# Altium project clock.PrjPcb (part 1 of 2)
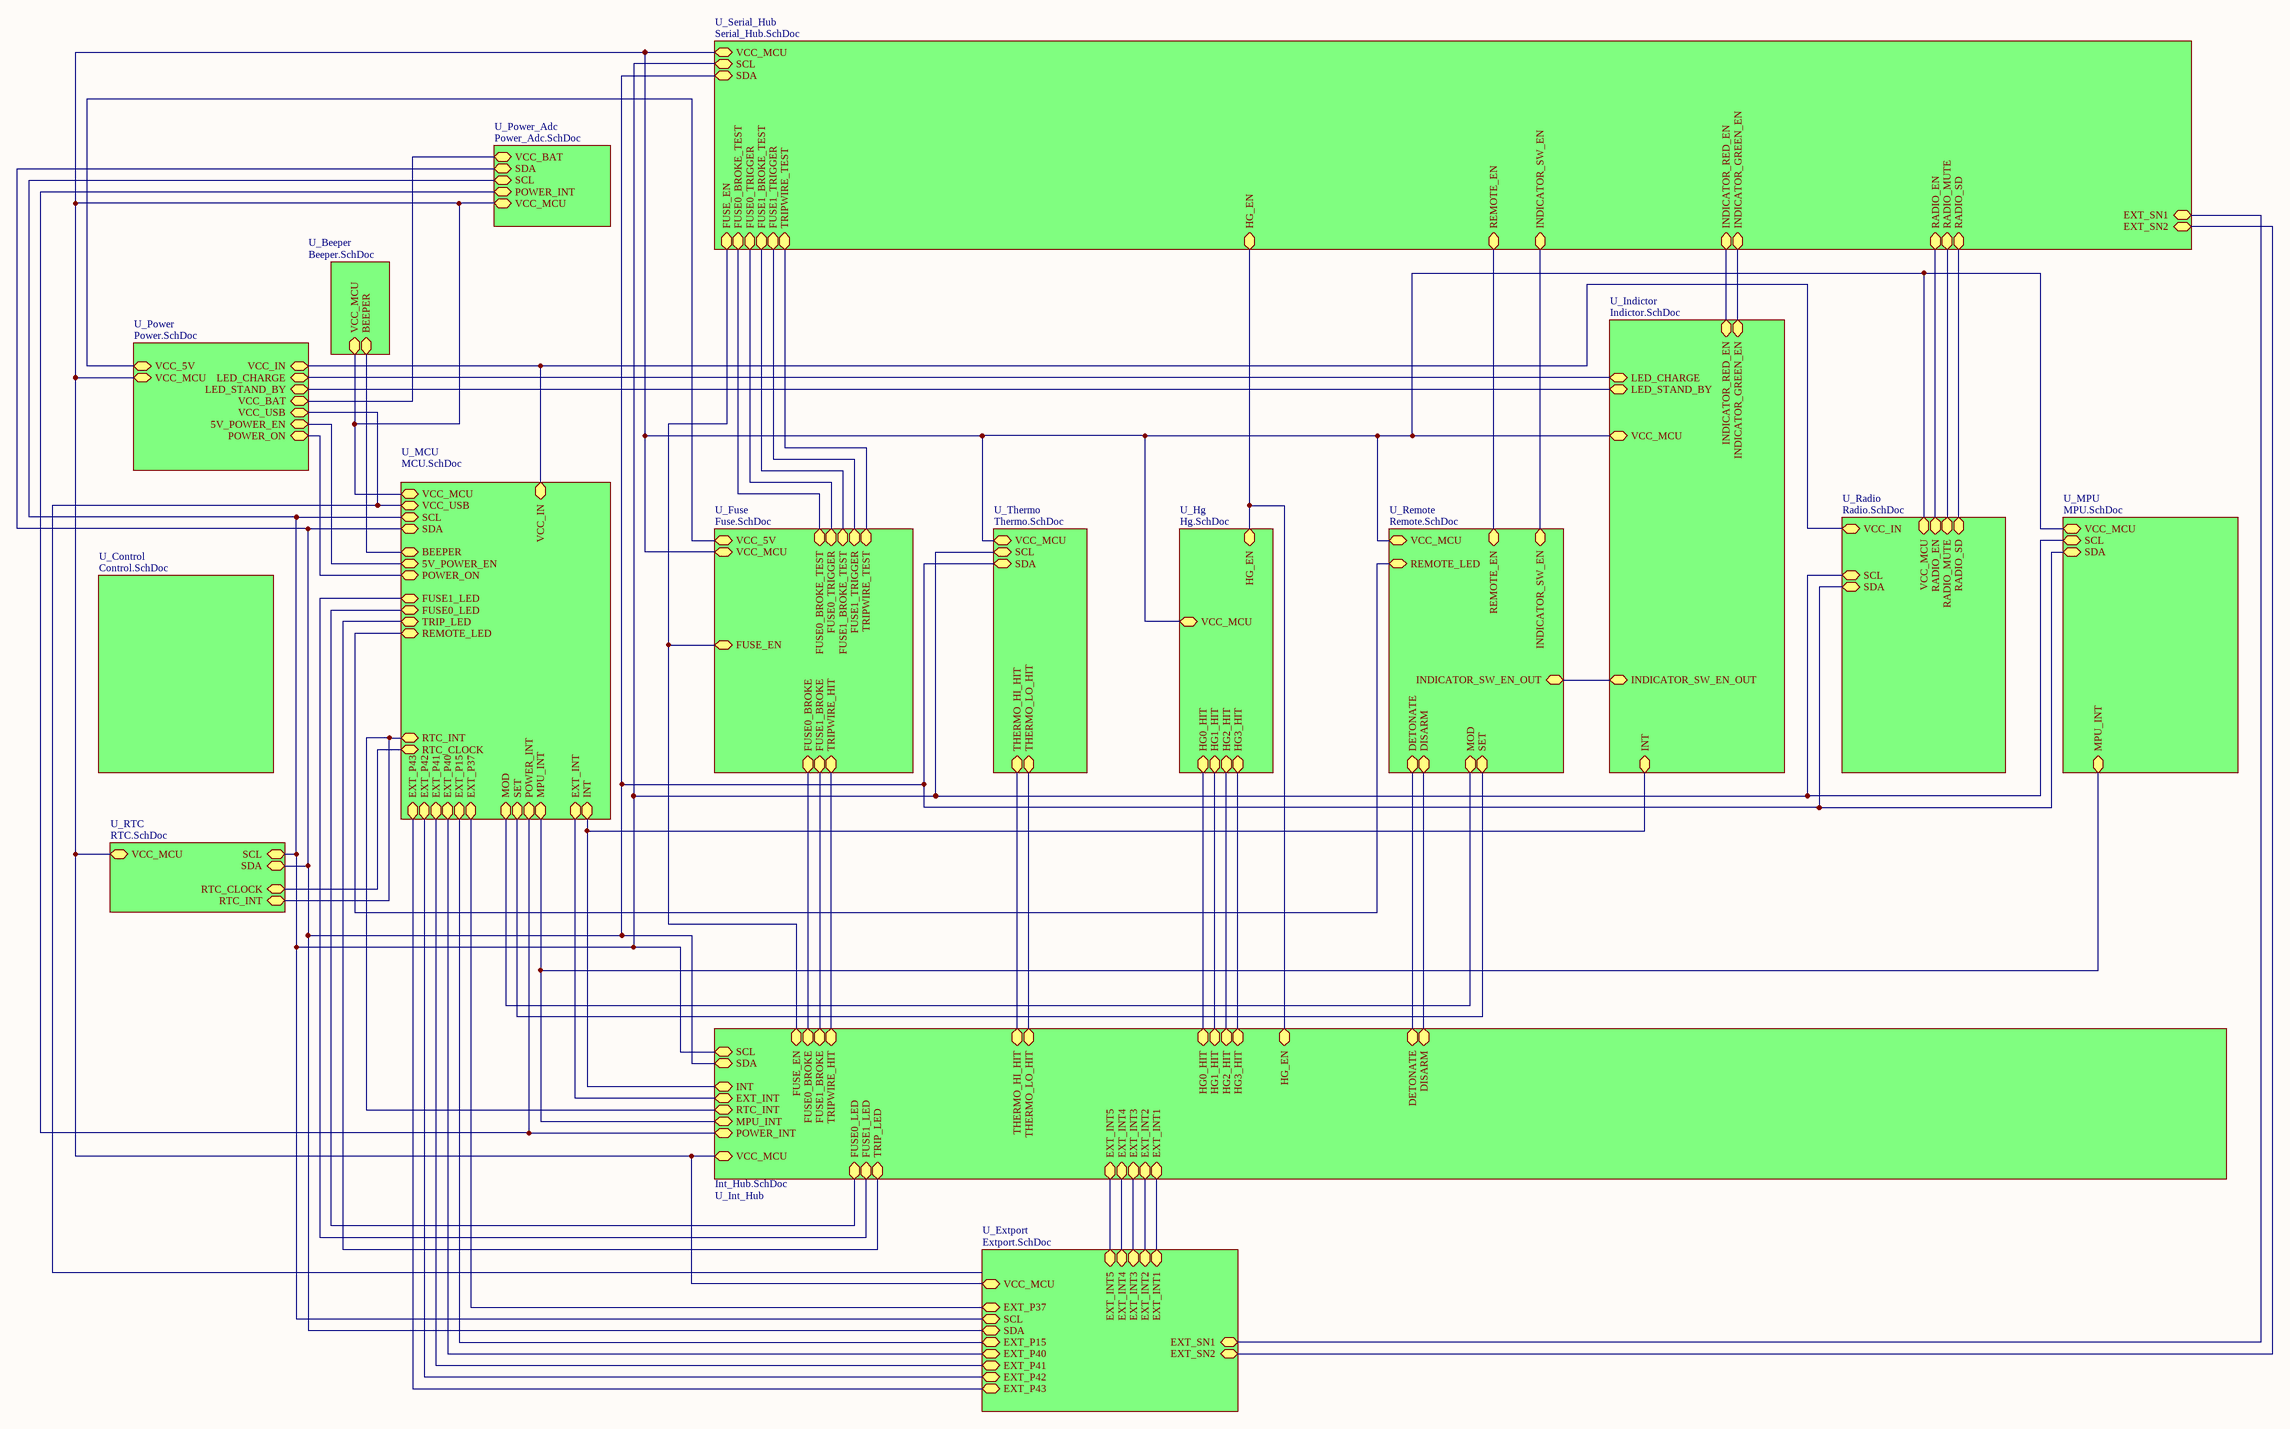
[diagram p0: Main.SchDoc]
17 sheets, 279 parts. Net scope: hierarchical (ports join the sheet entries above them; power ports are global).
Board files: Main.PcbDoc, DSS0012A.PcbDoc, DRC0010G.PcbDoc, DBV6.PcbDoc, sot23.PcbDoc, QFN24.PcbDoc
Sheets:
  Main.SchDoc
    U_Power = Power.SchDoc
    U_MCU = MCU.SchDoc
    U_RTC = RTC.SchDoc
    U_Fuse = Fuse.SchDoc
    U_MPU = MPU.SchDoc
    U_Hg = Hg.SchDoc
    U_Thermo = Thermo.SchDoc
    U_Indictor = Indictor.SchDoc
    U_Radio = Radio.SchDoc
    U_Serial_Hub = Serial_Hub.SchDoc
    U_Int_Hub = Int_Hub.SchDoc
    U_Remote = Remote.SchDoc
    U_Beeper = Beeper.SchDoc
    U_Power_Adc = Power_Adc.SchDoc
    U_Control = Control.SchDoc
    U_Extport = Extport.SchDoc

## Sheet Main.SchDoc
size A2

### Sub-sheets
U_Beeper = Beeper.SchDoc: BEEPER (bidir), VCC_MCU (bidir)
U_Control = Control.SchDoc: no entries
U_Extport = Extport.SchDoc: SDA (bidir), VCC_MCU (bidir), EXT_INT5 (bidir), EXT_INT4 (bidir), EXT_INT3 (bidir), EXT_INT2 (bidir), EXT_INT1 (bidir), EXT_SN1 (bidir), EXT_SN2 (bidir), EXT_P15 (bidir), EXT_P40 (bidir), EXT_P41 (bidir), EXT_P42 (bidir), EXT_P43 (bidir), EXT_P37 (bidir), SCL (bidir)
U_Fuse = Fuse.SchDoc: VCC_5V (bidir), FUSE0_TRIGGER (bidir), FUSE0_BROKE (bidir), FUSE0_BROKE_TEST (bidir), VCC_MCU (bidir), FUSE_EN (bidir), FUSE1_TRIGGER (bidir), FUSE1_BROKE (bidir), FUSE1_BROKE_TEST (bidir), TRIPWIRE_HIT (bidir), TRIPWIRE_TEST (bidir)
U_Hg = Hg.SchDoc: VCC_MCU (bidir), HG_EN (bidir), HG0_HIT (bidir), HG1_HIT (bidir), HG2_HIT (bidir), HG3_HIT (bidir)
U_Indictor = Indictor.SchDoc: VCC_MCU (bidir), INDICATOR_RED_EN (bidir), INDICATOR_GREEN_EN (bidir), INT (bidir), LED_CHARGE (bidir), LED_STAND_BY (bidir), INDICATOR_SW_EN_OUT (bidir)
U_Int_Hub = Int_Hub.SchDoc: VCC_MCU (bidir), SCL (bidir), SDA (bidir), INT (bidir), FUSE0_BROKE (bidir), FUSE1_BROKE (bidir), HG0_HIT (bidir), HG1_HIT (bidir), HG2_HIT (bidir), HG3_HIT (bidir), FUSE_EN (bidir), HG_EN (bidir), TRIPWIRE_HIT (bidir), EXT_INT (bidir), RTC_INT (bidir), MPU_INT (bidir), THERMO_HI_HIT (bidir), THERMO_LO_HIT (bidir), POWER_INT (bidir), DETONATE (bidir), DISARM (bidir), TRIP_LED (bidir), FUSE0_LED (bidir), FUSE1_LED (bidir), EXT_INT5 (bidir), EXT_INT4 (bidir), EXT_INT1 (bidir), EXT_INT2 (bidir), EXT_INT3 (bidir)
U_MCU = MCU.SchDoc: VCC_MCU (bidir), BEEPER (bidir), RTC_INT (bidir), EXT_INT (bidir), INT (bidir), RTC_CLOCK (bidir), VCC_USB (bidir), 5V_POWER_EN (bidir), POWER_INT (bidir), SCL (bidir), SDA (bidir), MOD (bidir), SET (bidir), POWER_ON (bidir), VCC_IN (bidir), MPU_INT (bidir), FUSE1_LED (bidir), FUSE0_LED (bidir), TRIP_LED (bidir), REMOTE_LED (bidir), EXT_P41 (bidir), EXT_P42 (bidir), EXT_P40 (bidir), EXT_P15 (bidir), EXT_P43 (bidir), EXT_P37 (bidir)
U_MPU = MPU.SchDoc: VCC_MCU (bidir), SCL (bidir), SDA (bidir), MPU_INT (bidir)
U_Power = Power.SchDoc: VCC_BAT (bidir), VCC_MCU (bidir), LED_CHARGE (bidir), LED_STAND_BY (bidir), VCC_IN (bidir), VCC_5V (bidir), 5V_POWER_EN (bidir), POWER_ON (bidir), VCC_USB (bidir)
U_Power_Adc = Power_Adc.SchDoc: VCC_BAT (bidir), SDA (bidir), SCL (bidir), POWER_INT (bidir), VCC_MCU (bidir)
U_Radio = Radio.SchDoc: VCC_IN (bidir), RADIO_EN (bidir), SDA (bidir), SCL (bidir), RADIO_MUTE (bidir), RADIO_SD (bidir), VCC_MCU (bidir)
U_Remote = Remote.SchDoc: VCC_MCU (bidir), REMOTE_EN (bidir), SET (bidir), MOD (bidir), DISARM (bidir), DETONATE (bidir), INDICATOR_SW_EN (bidir), INDICATOR_SW_EN_OUT (bidir), REMOTE_LED (bidir)
U_RTC = RTC.SchDoc: VCC_MCU (bidir), SCL (bidir), SDA (bidir), RTC_CLOCK (bidir), RTC_INT (bidir)
U_Serial_Hub = Serial_Hub.SchDoc: HG_EN (bidir), FUSE0_TRIGGER (bidir), FUSE1_TRIGGER (bidir), SCL (bidir), SDA (bidir), VCC_MCU (bidir), FUSE_EN (bidir), FUSE0_BROKE_TEST (bidir), FUSE1_BROKE_TEST (bidir), TRIPWIRE_TEST (bidir), INDICATOR_SW_EN (bidir), INDICATOR_RED_EN (bidir), INDICATOR_GREEN_EN (bidir), RADIO_MUTE (bidir), RADIO_SD (bidir), RADIO_EN (bidir), REMOTE_EN (bidir), EXT_SN1 (bidir), EXT_SN2 (bidir)
U_Thermo = Thermo.SchDoc: SCL (bidir), SDA (bidir), THERMO_HI_HIT (bidir), THERMO_LO_HIT (bidir), VCC_MCU (bidir)

### Nets
VCC_5V: sheet U_Power/VCC_5V, sheet U_Fuse/VCC_5V
VCC_BAT: sheet U_Power/VCC_BAT, sheet U_Power_Adc/VCC_BAT
VCC_IN: sheet U_Power/VCC_IN, sheet U_MCU/VCC_IN, sheet U_Radio/VCC_IN
VCC_MCU: sheet U_Power/VCC_MCU, sheet U_MCU/VCC_MCU, sheet U_RTC/VCC_MCU, sheet U_Fuse/VCC_MCU, sheet U_MPU/VCC_MCU, sheet U_Hg/VCC_MCU, sheet U_Thermo/VCC_MCU, sheet U_Indictor/VCC_MCU, sheet U_Radio/VCC_MCU, sheet U_Serial_Hub/VCC_MCU, sheet U_Int_Hub/VCC_MCU, sheet U_Remote/VCC_MCU, sheet U_Beeper/VCC_MCU, sheet U_Power_Adc/VCC_MCU, sheet U_Extport/VCC_MCU
VCC_USB: sheet U_Power/VCC_USB, sheet U_MCU/VCC_USB
EXT_INT: sheet U_MCU/EXT_INT, sheet U_Int_Hub/EXT_INT
MOD: sheet U_MCU/MOD, sheet U_Remote/MOD
MPU_INT: sheet U_MCU/MPU_INT, sheet U_MPU/MPU_INT, sheet U_Int_Hub/MPU_INT
POWER_INT: sheet U_MCU/POWER_INT, sheet U_Int_Hub/POWER_INT, sheet U_Power_Adc/POWER_INT
POWER_ON: sheet U_Power/POWER_ON, sheet U_MCU/POWER_ON
RTC_INT: sheet U_MCU/RTC_INT, sheet U_RTC/RTC_INT, sheet U_Int_Hub/RTC_INT
SCL: sheet U_MCU/SCL, sheet U_RTC/SCL, sheet U_MPU/SCL, sheet U_Thermo/SCL, sheet U_Radio/SCL, sheet U_Serial_Hub/SCL, sheet U_Int_Hub/SCL, sheet U_Power_Adc/SCL, sheet U_Extport/SCL
SDA: sheet U_MCU/SDA, sheet U_RTC/SDA, sheet U_MPU/SDA, sheet U_Thermo/SDA, sheet U_Radio/SDA, sheet U_Serial_Hub/SDA, sheet U_Int_Hub/SDA, sheet U_Power_Adc/SDA, sheet U_Extport/SDA
SET: sheet U_MCU/SET, sheet U_Remote/SET
NetK1_5: sheet U_Fuse/FUSE1_BROKE, sheet U_Int_Hub/FUSE1_BROKE
NetK2_5: sheet U_Fuse/FUSE0_BROKE, sheet U_Int_Hub/FUSE0_BROKE
NetP1_2: sheet U_Fuse/TRIPWIRE_HIT, sheet U_Int_Hub/TRIPWIRE_HIT
NetP10_2: sheet U_MCU/EXT_P37, sheet U_Extport/EXT_P37
NetP10_3: sheet U_Int_Hub/EXT_INT5, sheet U_Extport/EXT_INT5
NetP10_4: sheet U_MCU/EXT_P15, sheet U_Extport/EXT_P15
NetP10_5: sheet U_Int_Hub/EXT_INT4, sheet U_Extport/EXT_INT4
NetP10_6: sheet U_MCU/EXT_P40, sheet U_Extport/EXT_P40
NetP10_7: sheet U_Int_Hub/EXT_INT3, sheet U_Extport/EXT_INT3
NetP10_8: sheet U_MCU/EXT_P41, sheet U_Extport/EXT_P41
NetP10_9: sheet U_Int_Hub/EXT_INT2, sheet U_Extport/EXT_INT2
NetP10_10: sheet U_MCU/EXT_P42, sheet U_Extport/EXT_P42
NetP10_11: sheet U_Int_Hub/EXT_INT1, sheet U_Extport/EXT_INT1
NetP10_12: sheet U_MCU/EXT_P43, sheet U_Extport/EXT_P43
NetP10_13: sheet U_Serial_Hub/EXT_SN1, sheet U_Extport/EXT_SN1
NetP10_15: sheet U_Serial_Hub/EXT_SN2, sheet U_Extport/EXT_SN2
NetQ2_2: sheet U_Hg/HG_EN, sheet U_Serial_Hub/HG_EN, sheet U_Int_Hub/HG_EN
NetQ11_2: sheet U_Fuse/FUSE_EN, sheet U_Serial_Hub/FUSE_EN, sheet U_Int_Hub/FUSE_EN
NetQ14_2: sheet U_Power/5V_POWER_EN, sheet U_MCU/5V_POWER_EN
NetQ18_2: sheet U_Radio/RADIO_EN, sheet U_Serial_Hub/RADIO_EN
NetQ19_2: sheet U_Serial_Hub/REMOTE_EN, sheet U_Remote/REMOTE_EN
NetR1_1: sheet U_MCU/BEEPER, sheet U_Beeper/BEEPER
NetR3_1: sheet U_Hg/HG0_HIT, sheet U_Int_Hub/HG0_HIT
NetR4_1: sheet U_Hg/HG2_HIT, sheet U_Int_Hub/HG2_HIT
NetR5_1: sheet U_Hg/HG1_HIT, sheet U_Int_Hub/HG1_HIT
NetR6_1: sheet U_Hg/HG3_HIT, sheet U_Int_Hub/HG3_HIT
NetR8_1: sheet U_MCU/FUSE0_LED, sheet U_Int_Hub/FUSE0_LED
NetR9_1: sheet U_MCU/TRIP_LED, sheet U_Int_Hub/TRIP_LED
NetR11_1: sheet U_MCU/INT, sheet U_Indictor/INT, sheet U_Int_Hub/INT
NetR12_1: sheet U_MCU/FUSE1_LED, sheet U_Int_Hub/FUSE1_LED
NetR19_1: sheet U_MCU/RTC_CLOCK, sheet U_RTC/RTC_CLOCK
NetR20_1: sheet U_Thermo/THERMO_HI_HIT, sheet U_Int_Hub/THERMO_HI_HIT
NetR21_1: sheet U_Thermo/THERMO_LO_HIT, sheet U_Int_Hub/THERMO_LO_HIT
NetR22_1: sheet U_Fuse/TRIPWIRE_TEST, sheet U_Serial_Hub/TRIPWIRE_TEST
NetR25_1: sheet U_Fuse/FUSE1_BROKE_TEST, sheet U_Serial_Hub/FUSE1_BROKE_TEST
NetR26_1: sheet U_Fuse/FUSE0_BROKE_TEST, sheet U_Serial_Hub/FUSE0_BROKE_TEST
NetR28_1: sheet U_Fuse/FUSE1_TRIGGER, sheet U_Serial_Hub/FUSE1_TRIGGER
NetR30_1: sheet U_Fuse/FUSE0_TRIGGER, sheet U_Serial_Hub/FUSE0_TRIGGER
NetR39_1: sheet U_Indictor/INDICATOR_SW_EN_OUT, sheet U_Remote/INDICATOR_SW_EN_OUT
NetR41_2: sheet U_Power/LED_CHARGE, sheet U_Indictor/LED_CHARGE
NetR42_2: sheet U_Power/LED_STAND_BY, sheet U_Indictor/LED_STAND_BY
NetR87_1: sheet U_Int_Hub/DISARM, sheet U_Remote/DISARM
NetR88_1: sheet U_Int_Hub/DETONATE, sheet U_Remote/DETONATE
NetR109_2: sheet U_MCU/REMOTE_LED, sheet U_Remote/REMOTE_LED
NetU8_15: sheet U_Serial_Hub/INDICATOR_SW_EN, sheet U_Remote/INDICATOR_SW_EN
NetU8_16: sheet U_Indictor/INDICATOR_RED_EN, sheet U_Serial_Hub/INDICATOR_RED_EN
NetU8_17: sheet U_Indictor/INDICATOR_GREEN_EN, sheet U_Serial_Hub/INDICATOR_GREEN_EN
NetU8_18: sheet U_Radio/RADIO_SD, sheet U_Serial_Hub/RADIO_SD
NetU8_19: sheet U_Radio/RADIO_MUTE, sheet U_Serial_Hub/RADIO_MUTE

## Sheet Power.SchDoc
size A3
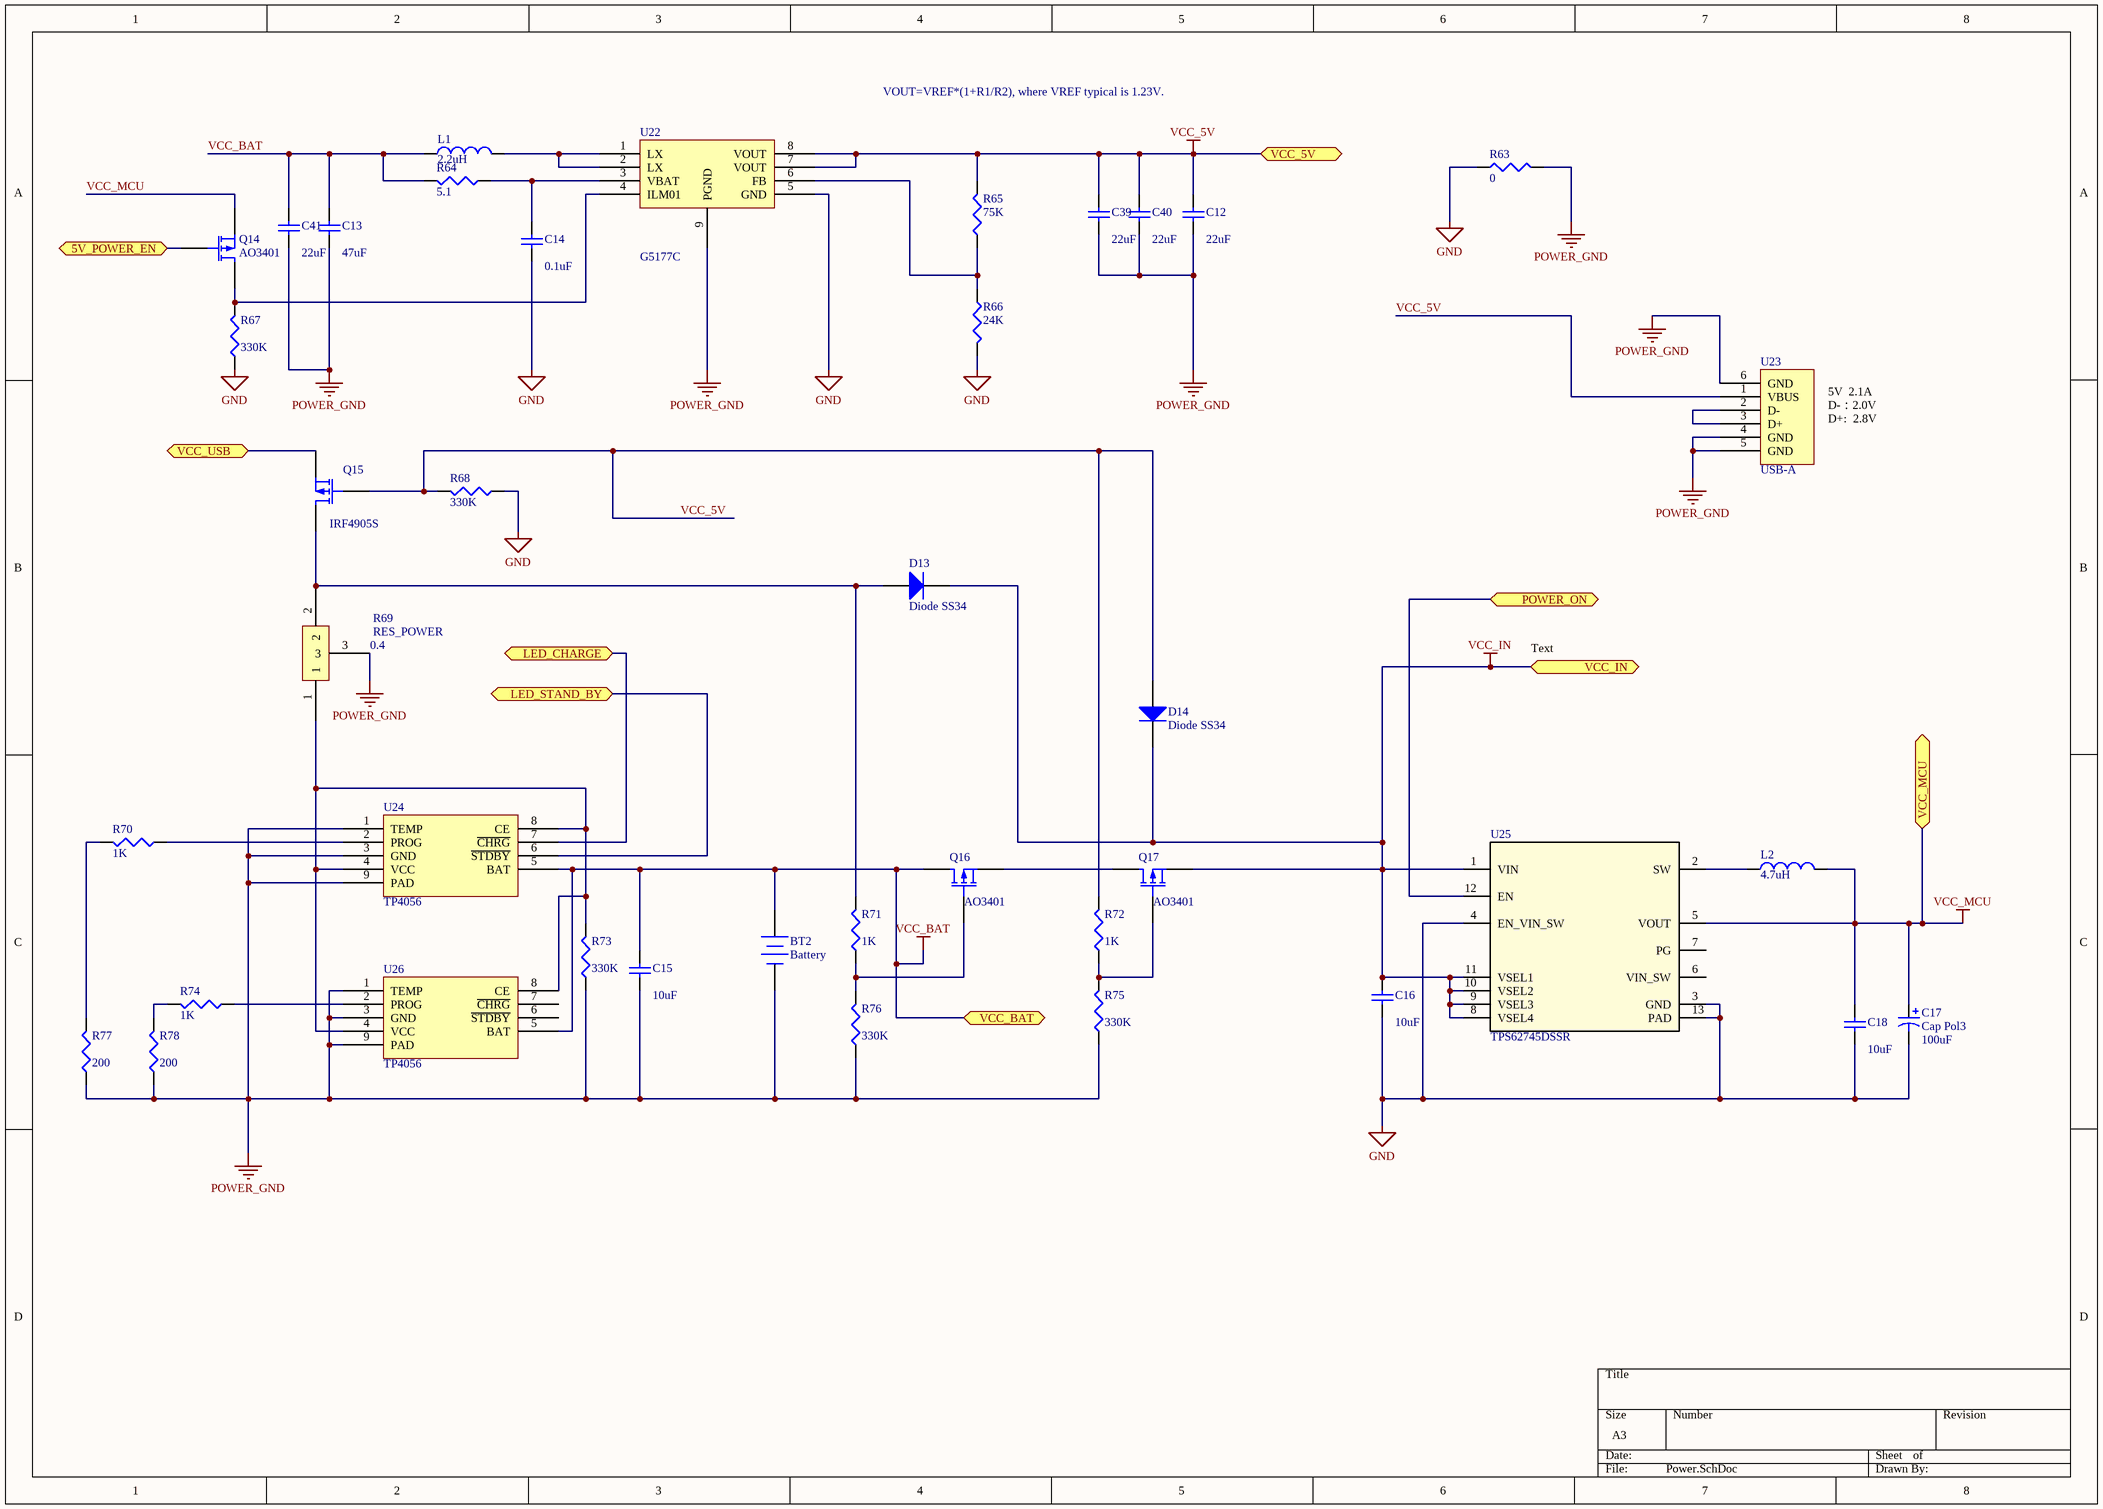
[diagram p1: Power.SchDoc]

### Parts
BT2  Battery  [18650X4]
C12  value 22uF  [1206]  (hidden comment: Cap Semi)
C13  value 47uF  [1210]  (hidden comment: Cap Semi)
C14  value 0.1uF  [0603]  (hidden comment: Cap Semi)
C15  value 10uF  [0603]  (hidden comment: Cap Semi)
C16  value 10uF  [0603]  (hidden comment: Cap Semi)
C17  Cap Pol3  value 100uF  [TC7343-2917]
C18  value 10uF  [0603]  (hidden comment: Cap Semi)
C39  value 22uF  [1206]  (hidden comment: Cap Semi)
C40  value 22uF  [1206]  (hidden comment: Cap Semi)
C41  value 22uF  [1206]  (hidden comment: Cap Semi)
D13  Diode SS34  [SMA]
D14  Diode SS34  [SMA]
L1  value 2.2uH  [WNC0630]  (hidden comment: Inductor)
L2  value 4.7uH  [2520]  (hidden comment: Inductor)
Q14  AO3401  [SOT23-3-PMOS]
Q15  IRF4905S  [D2PAK]
Q16  AO3401  [SOT23-3-PMOS]
Q17  AO3401  [SOT23-3-PMOS]
R63  value 0  [0603]  (hidden comment: Res3)
R64  value 5.1  [0603]  (hidden comment: Res3)
R65  value 75K  [0603]  (hidden comment: Res3)
R66  value 24K  [0603]  (hidden comment: Res3)
R67  value 330K  [0603]  (hidden comment: Res3)
R68  value 330K  [0603]  (hidden comment: Res3)
R69  RES_POWER  value 0.4  [RES_POWER]
R70  value 1K  [0603]  (hidden comment: Res3)
R71  value 1K  [0603]  (hidden comment: Res3)
R72  value 1K  [0603]  (hidden comment: Res3)
R73  value 330K  [0603]  (hidden comment: Res3)
R74  value 1K  [0603]  (hidden comment: Res3)
R75  value 330K  [0603]  (hidden comment: Res3)
R76  value 330K  [0603]  (hidden comment: Res3)
R77  value 200  [0603]  (hidden comment: Res3)
R78  value 200  [0603]  (hidden comment: Res3)
U22  G5177C  [SOP8-PAD]
U23  USB-A  [USB2.5-2H4C]
U24  TP4056  [SOP8-PAD]
U25  TPS62745DSSR  [DSS0012A]
U26  TP4056  [SOP8-PAD]

### Ports
5V_POWER_EN (bidir), LED_CHARGE (bidir), LED_STAND_BY (bidir), POWER_ON (bidir), VCC_5V (bidir), VCC_BAT (bidir), VCC_IN (bidir), VCC_MCU (bidir), VCC_USB (bidir)

### Nets
GND: C14.1 C16.1 C17.2 C18.1 R63.1 R66.2 R67.1 R68.1 U22.5(GND) U25.3(GND) U25.4(EN_VIN_SW) U25.13(PAD)
POWER_GND: BT2.2(-) C12.1 C13.1 C15.1 C39.1 C40.1 C41.1 R63.2 R69.3 R73.1 R75.1 R76.1 R77.1 R78.1 U22.9(PGND) U23.4(GND) U23.5(GND) U23.6(GND) U24.1(TEMP) U24.3(GND) U24.9(PAD) U26.1(TEMP) U26.3(GND) U26.9(PAD)
VCC_5V: C12.2 C39.2 C40.2 D14.1(A) Q15.2(G) R65.2 R68.2 R72.2 U22.7(VOUT) U22.8(VOUT) U23.1(VBUS) ; port VCC_5V
VCC_BAT: BT2.1(+) C13.2 C15.2 C41.2 L1.1 Q16.1(D) R64.2 U24.5(BAT) U26.5(BAT) ; port VCC_BAT
VCC_IN: C16.2 D13.2(K) D14.2(K) Q17.3(S) U25.1(VIN) U25.8(VSEL4) U25.9(VSEL3) U25.10(VSEL2) U25.11(VSEL1) ; port VCC_IN
VCC_MCU: C17.1 C18.2 L2.2 Q14.3(S) U25.5(VOUT) ; port VCC_MCU
VCC_USB: Q15.3(S) ; port VCC_USB
POWER_ON: U25.12(EN) ; port POWER_ON
NetC14_2: C14.2 R64.1 U22.3(VBAT)
NetD13_1: D13.1(A) Q15.1(D) R69.2 R71.2
NetL1_2: L1.2 U22.1(LX) U22.2(LX)
NetL2_1: L2.1 U25.2(SW)
NetQ14_1: Q14.1(D) R67.2 U22.4(ILM01)
NetQ14_2: Q14.2(G) ; port 5V_POWER_EN
NetQ16_2: Q16.2(G) R71.1 R76.2
NetQ16_3: Q16.3(S) Q17.1(D)
NetQ17_2: Q17.2(G) R72.1 R75.2
NetR41_2: U24.7(~{CHRG}) ; port LED_CHARGE
NetR42_2: U24.6(~{STDBY}) ; port LED_STAND_BY
NetR65_1: R65.1 R66.1 U22.6(FB)
NetR69_1: R69.1 R73.2 U24.4(VCC) U24.8(CE) U26.4(VCC) U26.8(CE)
NetR70_1: R70.1 U24.2(PROG)
NetR70_2: R70.2 R77.2
NetR74_1: R74.1 U26.2(PROG)
NetR74_2: R74.2 R78.2
NetU23_2: U23.2(D-) U23.3(D+)

Not connected (* = marked no-connect by the designer): U25 6(VIN_SW) 7(PG); U26 6(~{STDBY}) 7(~{CHRG})

### Notes on the sheet
- VOUT=VREF*(1+R1/R2), where VREF typical is 1.23V.
- 5V  2.1A
  D-：2.0V
  D+:  2.8V
- Text

### Library data of the parts
BT2 = Battery: Multicell Battery; Published: 24-Mar-1999; LatestRevisionDate: 17-Jul-2002; LatestRevisionNote: Re-released for DXP Platform.; PackageReference: BAT-2; Publisher: Altium Limited; PackageDescription: Battery; 2 Leads
C12-C16 C18 C39-C41 = Cap Semi: Capacitor (Semiconductor SIM Model); Published: 8-Jun-2000; LatestRevisionDate: 29-May-2009; LatestRevisionNote: IPC-7351 Footprint Added.; PackageReference: C1206; Publisher: Altium Limited; PackageDescription: Chip Capacitor
C17 = Cap Pol3: Polarized Capacitor (Surface Mount); Published: 8-Jun-2000; LatestRevisionDate: 29-May-2009; LatestRevisionNote: IPC-7351 Footprint Added.; PackageReference: C0805; Publisher: Altium Limited; PackageDescription: Chip Capacitor
D13 D14 = Diode 1N4005: 1 Amp General Purpose Rectifier; Published: 8-Jun-2000; LatestRevisionDate: 17-Jul-2002; LatestRevisionNote: Re-released for DXP Platform.; DatasheetVersion: 1998; PackageVersion: Aug-1999; PackageReference: DO-41; Publisher: Altium Limited; PackageDescription: Diode, Axial; Body 5.2 x 2.7 mm (LxDia. max), Lead Dia. 0.86 mm (max); Code_JEDEC: DO-204-AL; ComponentLink1Description: Manufacturer Link; ComponentLink1URL: http://www.fairchildsemi.com/; ComponentLink2Description: Datasheet; ComponentLink2URL: http://www.fairchildsemi.com/ds/1N%2F1N4001.pdf
L1 L2 = Inductor: Code_IEC: 1005; Published: 8-Jun-2000; LatestRevisionDate: 29-May-2009; LatestRevisionNote: IPC-7351 Footprint Added.; PackageReference: 0402-A; Publisher: Altium Limited; PackageDescription: Chip Inductor; Code_JEITA: 0402
Q14-Q17 = MOSFET-P: P-Channel MOSFET; Published: 8-Jun-2000; LatestRevisionDate: 17-Jul-2002; LatestRevisionNote: Re-released for DXP Platform.; PackageVersion: 1995/1996; PackageReference: E3; Publisher: Altium Limited; PackageDescription: TO, Flat Index; 3 In-Line, Axial Leads; Body Dia. 4.6mm; Lead Dia. 0.5 mm (max)
R63-R68 R70-R78 = Res3: Resistor; Published: 8-Jun-2000; LatestRevisionDate: 29-May-2009; LatestRevisionNote: IPC-7351 Footprint Added.; PackageReference: J1-0603; Publisher: Altium Limited; PackageDescription: Chip Resistor
U25 = TPS62745DSSR: Imported; Alternate PartNumber: TPS62745DSST; Manufacturer: Texas Instruments; CompType: IC; PIN_COUNT: 13; Application_BuildNumber: *; PartNumber: TPS62745DSSR; PackageReference: DSS0012A; MountType: SMT; RoHS: Y; RefDes: RefDes; Type: DEV

## Sheet MCU.SchDoc
size A3
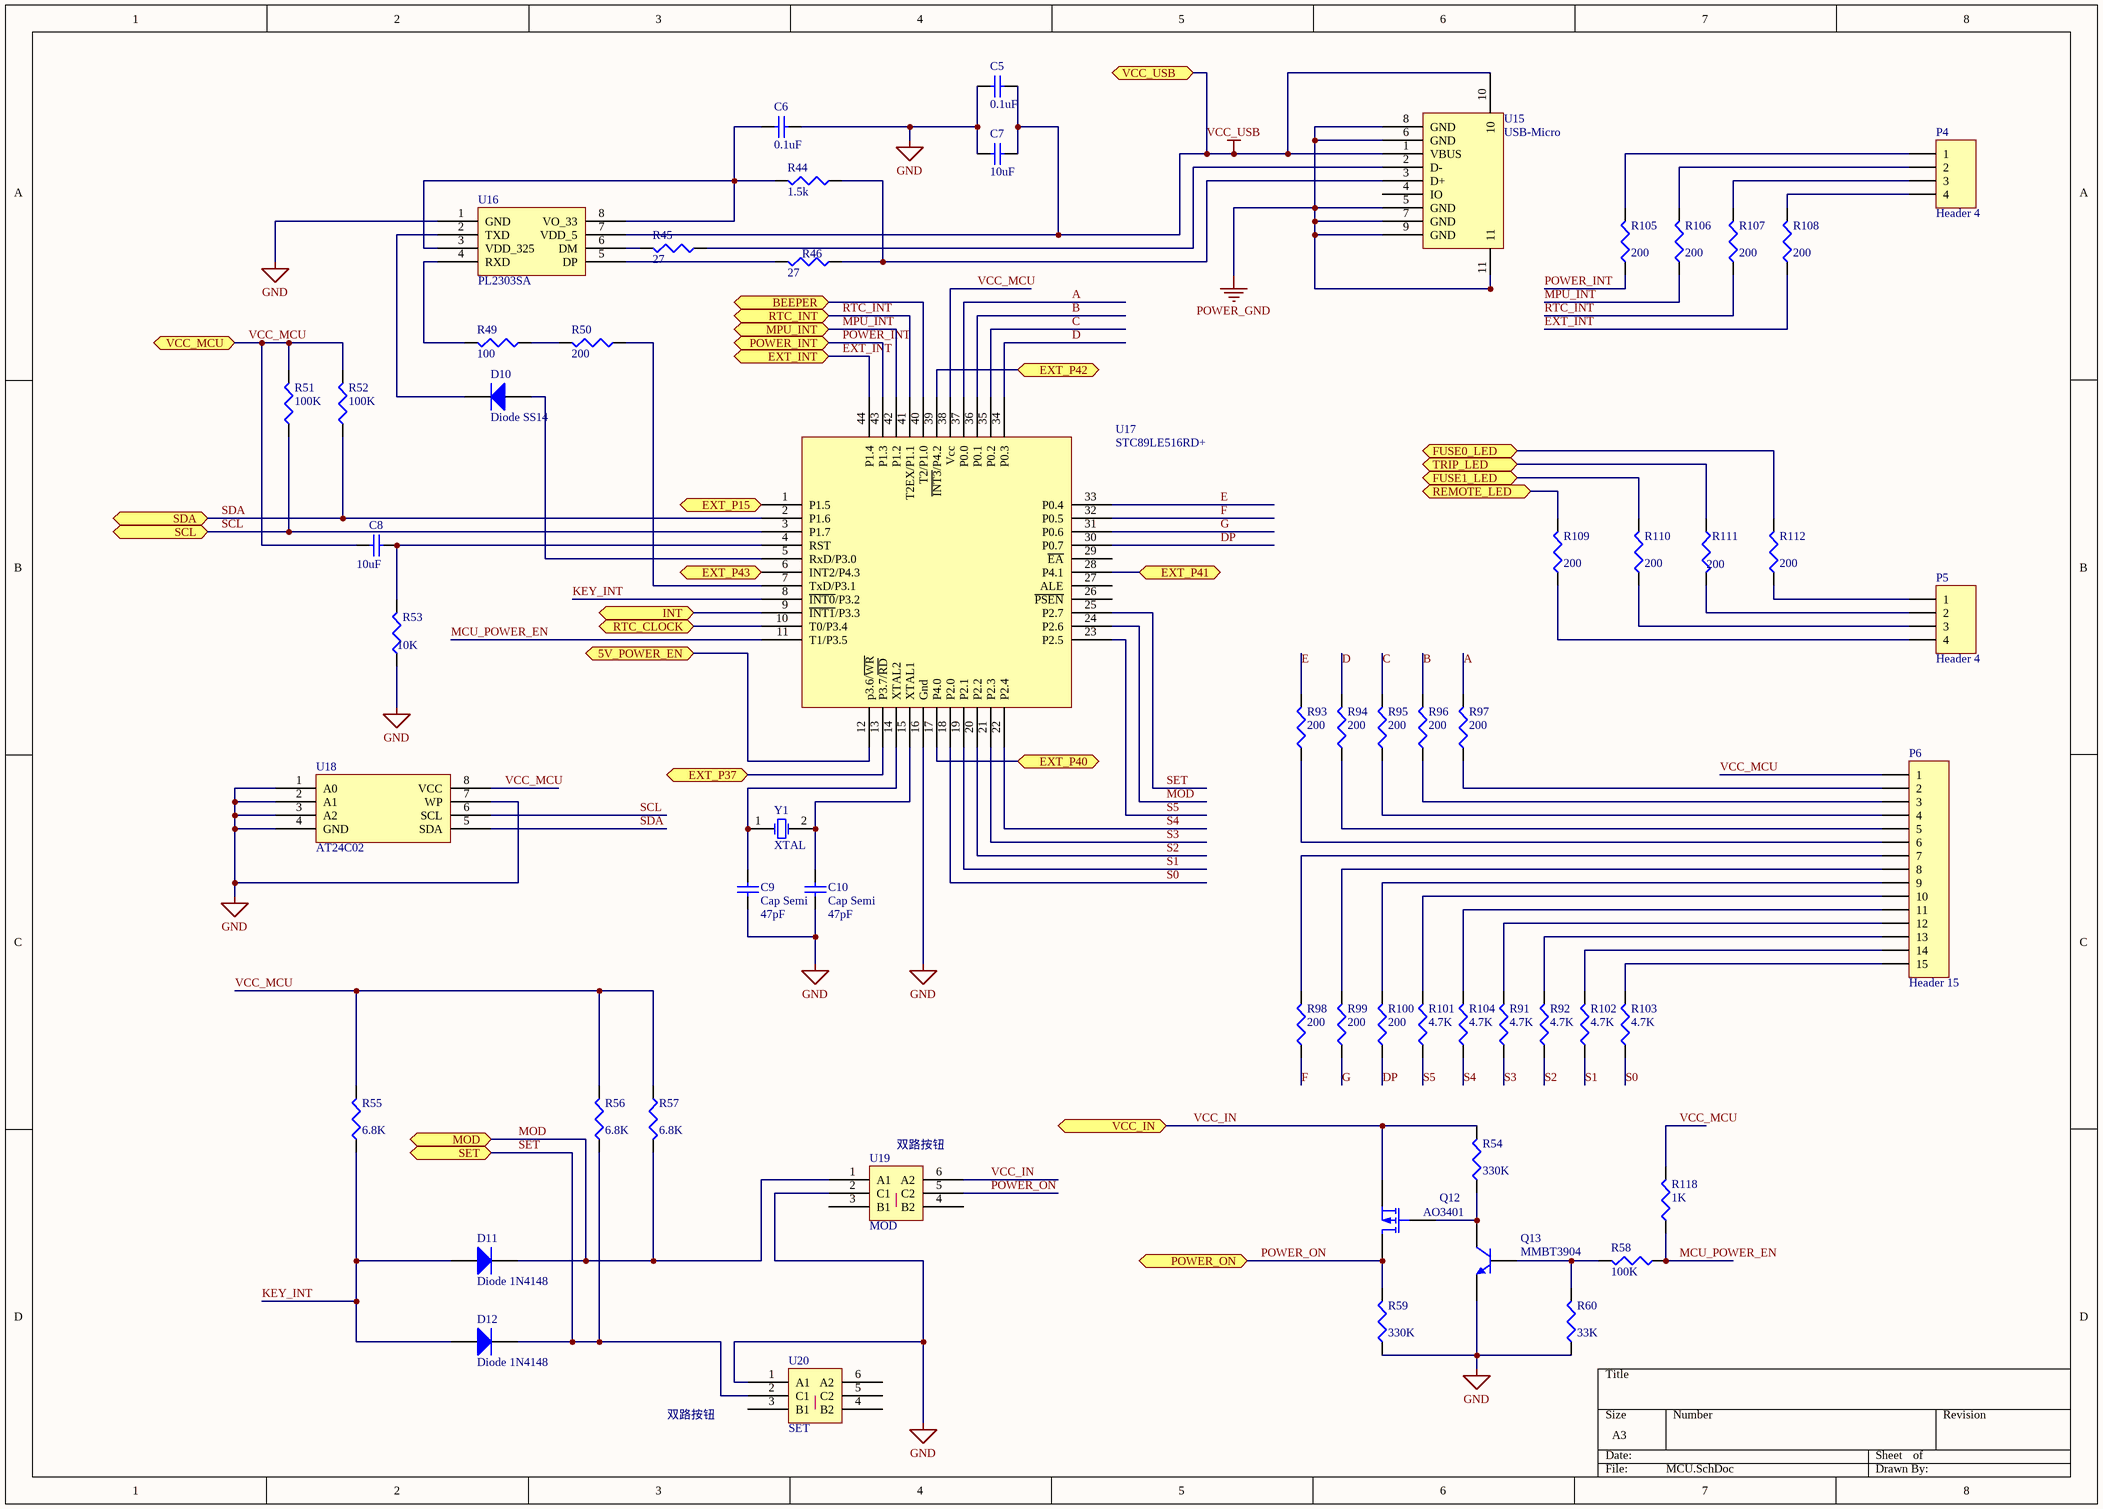
[diagram p2: MCU.SchDoc]

### Parts
C5  value 0.1uF  [0603]  (hidden comment: Cap Semi)
C6  value 0.1uF  [0603]  (hidden comment: Cap Semi)
C7  value 10uF  [0603]  (hidden comment: Cap Semi)
C8  value 10uF  [0603]  (hidden comment: Cap Semi)
C9  Cap Semi  value 47pF  [0603]
C10  Cap Semi  value 47pF  [0603]
D10  Diode SS14  [SMA]
D11  Diode 1N4148  [1206D]
D12  Diode 1N4148  [1206D]
P4  Header 4  [HDR1X4]
P5  Header 4  [HDR1X4]
P6  Header 15  [HDR1X15]
Q12  AO3401  [SOT23-3-PMOS]
Q13  MMBT3904  [SOT23-3-NPN]
R44  value 1.5k  [0603]  (hidden comment: Res3)
R45  value 27  [0603]  (hidden comment: Res3)
R46  value 27  [0603]  (hidden comment: Res3)
R49  value 100  [0603]  (hidden comment: Res3)
R50  value 200  [0603]  (hidden comment: Res3)
R51  value 100K  [0603]  (hidden comment: Res3)
R52  value 100K  [0603]  (hidden comment: Res3)
R53  value 10K  [0603]  (hidden comment: Res3)
R54  value 330K  [0603]  (hidden comment: Res3)
R55  value 6.8K  [0603]  (hidden comment: Res3)
R56  value 6.8K  [0603]  (hidden comment: Res3)
R57  value 6.8K  [0603]  (hidden comment: Res3)
R58  value 100K  [0603]  (hidden comment: Res3)
R59  value 330K  [0603]  (hidden comment: Res3)
R60  value 33K  [0603]  (hidden comment: Res3)
R91  value 4.7K  [0603]  (hidden comment: Res3)
R92  value 4.7K  [0603]  (hidden comment: Res3)
R93  value 200  [0603]  (hidden comment: Res3)
R94  value 200  [0603]  (hidden comment: Res3)
R95  value 200  [0603]  (hidden comment: Res3)
R96  value 200  [0603]  (hidden comment: Res3)
R97  value 200  [0603]  (hidden comment: Res3)
R98  value 200  [0603]  (hidden comment: Res3)
R99  value 200  [0603]  (hidden comment: Res3)
R100  value 200  [0603]  (hidden comment: Res3)
R101  value 4.7K  [0603]  (hidden comment: Res3)
R102  value 4.7K  [0603]  (hidden comment: Res3)
R103  value 4.7K  [0603]  (hidden comment: Res3)
R104  value 4.7K  [0603]  (hidden comment: Res3)
R105  value 200  [0603]  (hidden comment: Res3)
R106  value 200  [0603]  (hidden comment: Res3)
R107  value 200  [0603]  (hidden comment: Res3)
R108  value 200  [0603]  (hidden comment: Res3)
R109  value 200  [0603]  (hidden comment: Res3)
R110  value 200  [0603]  (hidden comment: Res3)
R111  value 200  [0603]  (hidden comment: Res3)
R112  value 200  [0603]  (hidden comment: Res3)
R118  value 1K  [0603]  (hidden comment: Res3)
U15  USB-Micro  [USB-Micro]
U16  PL2303SA  [SOP8]
U17  STC89LE516RD+  [LQFP44]
U18  AT24C02  [SOP8]
U19  MOD  [HDR2X3]
U20  SET  [HDR2X3]
Y1  XTAL  [XTAL]

### Ports
5V_POWER_EN (bidir), BEEPER (bidir), EXT_INT (bidir), EXT_P15 (bidir), EXT_P37 (bidir), EXT_P40 (bidir), EXT_P41 (bidir), EXT_P42 (bidir), EXT_P43 (bidir), FUSE0_LED (bidir), FUSE1_LED (bidir), INT (bidir), MOD (bidir), MPU_INT (bidir), POWER_INT (bidir), POWER_ON (bidir), REMOTE_LED (bidir), RTC_CLOCK (bidir), RTC_INT (bidir), SCL (bidir), SDA (bidir), SET (bidir), TRIP_LED (bidir), VCC_IN (bidir), VCC_MCU (bidir), VCC_USB (bidir)

### Nets
GND: C5.1 C6.2 C7.1 C9.1 C10.1 Q13.1(E) R53.1 R59.1 R60.1 U16.1(GND) U17.16(Gnd) U18.1(A0) U18.2(A1) U18.3(A2) U18.4(GND) U18.7(WP) U19.2(C1) U20.1(A1)
POWER_GND: U15.5(GND) U15.6(GND) U15.7(GND) U15.8(GND) U15.9(GND) U15.11
VCC_IN: Q12.3(S) R54.2 U19.6(A2) ; port VCC_IN
VCC_MCU: C8.2 P6.1 R51.2 R52.2 R55.2 R56.2 R57.1 R118.2 U17.38(Vcc) U18.8(VCC) ; port VCC_MCU
VCC_USB: C5.2 C7.2 U15.1(VBUS) U15.10 U16.7(VDD_5) ; port VCC_USB
A: R97.2 U17.37(P0.0)
B: R96.2 U17.36(P0.1)
C: R95.2 U17.35(P0.2)
D: R94.2 U17.34(P0.3)
DP: R100.1 U17.30(P0.7)
E: R93.2 U17.33(P0.4)
EXT_INT: R108.1 U17.44(P1.4) ; port EXT_INT
F: R98.1 U17.32(P0.5)
G: R99.1 U17.31(P0.6)
KEY_INT: D11.1(A) D12.1(A) R55.1 U17.8(~{INT0}/P3.2)
MCU_POWER_EN: R58.1 R118.1 U17.11(T1/P3.5)
MOD: D11.2(K) R57.2 U17.24(P2.6) U19.1(A1) ; port MOD
MPU_INT: R106.1 U17.42(P1.2) ; port MPU_INT
POWER_INT: R105.1 U17.43(P1.3) ; port POWER_INT
POWER_ON: Q12.1(D) R59.2 U19.5(C2) ; port POWER_ON
RTC_INT: R107.1 U17.41(T2EX/P1.1) ; port RTC_INT
S0: R103.1 U17.18(P2.0)
S1: R102.1 U17.19(P2.1)
S2: R92.1 U17.20(P2.2)
S3: R91.1 U17.21(P2.3)
S4: R104.1 U17.22(P2.4)
S5: R101.1 U17.23(P2.5)
SCL: R51.1 U17.3(P1.7) U18.6(SCL) ; port SCL
SDA: R52.1 U17.2(P1.6) U18.5(SDA) ; port SDA
SET: D12.2(K) R56.1 U17.25(P2.7) U20.2(C1) ; port SET
NetC6_1: C6.1 R44.2 U16.3(VDD_325) U16.8(VO_33)
NetC8_1: C8.1 R53.2 U17.4(RST)
NetC9_2: C9.2 U17.14(XTAL2) Y1.1(OSC1)
NetC10_2: C10.2 U17.15(XTAL1) Y1.2(OSC2)
NetD10_1: D10.1(A) U17.5(RxD/P3.0)
NetD10_2: D10.2(K) U16.2(TXD)
NetP4_1: P4.1 R105.2
NetP4_2: P4.2 R106.2
NetP4_3: P4.3 R107.2
NetP4_4: P4.4 R108.2
NetP5_1: P5.1 R112.1
NetP5_2: P5.2 R111.2
NetP5_3: P5.3 R110.1
NetP5_4: P5.4 R109.1
NetP6_2: P6.2 R97.1
NetP6_3: P6.3 R96.1
NetP6_4: P6.4 R95.1
NetP6_5: P6.5 R94.1
NetP6_6: P6.6 R93.1
NetP6_7: P6.7 R98.2
NetP6_8: P6.8 R99.2
NetP6_9: P6.9 R100.2
NetP6_10: P6.10 R101.2
NetP6_11: P6.11 R104.2
NetP6_12: P6.12 R91.2
NetP6_13: P6.13 R92.2
NetP6_14: P6.14 R102.2
NetP6_15: P6.15 R103.2
NetP10_2: U17.13(P3.7/~{RD}) ; port EXT_P37
NetP10_4: U17.1(P1.5) ; port EXT_P15
NetP10_6: U17.17(P4.0) ; port EXT_P40
NetP10_8: U17.28(P4.1) ; port EXT_P41
NetP10_10: U17.39(~{INT3}/P4.2) ; port EXT_P42
NetP10_12: U17.6(INT2/P4.3) ; port EXT_P43
NetQ12_2: Q12.2(G) Q13.3(C) R54.1
NetQ13_2: Q13.2(B) R58.2 R60.2
NetQ14_2: U17.12(p3.6/~{WR}) ; port 5V_POWER_EN
NetR1_1: U17.40(T2/P1.0) ; port BEEPER
NetR8_1: R112.2 ; port FUSE0_LED
NetR9_1: R111.1 ; port TRIP_LED
NetR11_1: U17.9(~{INT1}/P3.3) ; port INT
NetR12_1: R110.2 ; port FUSE1_LED
NetR19_1: U17.10(T0/P3.4) ; port RTC_CLOCK
NetR44_1: R44.1 R46.1 U15.3(D+)
NetR45_1: R45.1 U15.2(D-)
NetR45_2: R45.2 U16.6(DM)
NetR46_2: R46.2 U16.5(DP)
NetR49_1: R49.1 R50.2
NetR49_2: R49.2 U16.4(RXD)
NetR50_1: R50.1 U17.7(TxD/P3.1)
NetR109_2: R109.2 ; port REMOTE_LED

Not connected (* = marked no-connect by the designer): U15 4(IO); U17 26(~{PSEN}) 27(ALE) 29(~{EA}); U19 3(B1) 4(B2); U20 3(B1) 4(B2) 5(C2) 6(A2)

### Notes on the sheet
- (near U19) 双路按钮
- 双路按钮

### Library data of the parts
C5-C10 = Cap Semi: Capacitor (Semiconductor SIM Model); Published: 8-Jun-2000; LatestRevisionDate: 29-May-2009; LatestRevisionNote: IPC-7351 Footprint Added.; PackageReference: C1206; Publisher: Altium Limited; PackageDescription: Chip Capacitor
D10-D12 = Diode 1N4005: 1 Amp General Purpose Rectifier; Published: 8-Jun-2000; LatestRevisionDate: 17-Jul-2002; LatestRevisionNote: Re-released for DXP Platform.; DatasheetVersion: 1998; PackageVersion: Aug-1999; PackageReference: DO-41; Publisher: Altium Limited; PackageDescription: Diode, Axial; Body 5.2 x 2.7 mm (LxDia. max), Lead Dia. 0.86 mm (max); Code_JEDEC: DO-204-AL; ComponentLink1Description: Manufacturer Link; ComponentLink1URL: http://www.fairchildsemi.com/; ComponentLink2Description: Datasheet; ComponentLink2URL: http://www.fairchildsemi.com/ds/1N%2F1N4001.pdf
P4 P5 = Header 4: Header, 4-Pin; LatestRevisionDate: 17-Jul-2002; LatestRevisionNote: Re-released for DXP Platform.; Publisher: Altium Limited
P6 = Header 15: Header, 15-Pin; LatestRevisionDate: 17-Jul-2002; LatestRevisionNote: Re-released for DXP Platform.; Publisher: Altium Limited
Q12 = MOSFET-P: P-Channel MOSFET; Published: 8-Jun-2000; LatestRevisionDate: 17-Jul-2002; LatestRevisionNote: Re-released for DXP Platform.; PackageVersion: 1995/1996; PackageReference: E3; Publisher: Altium Limited; PackageDescription: TO, Flat Index; 3 In-Line, Axial Leads; Body Dia. 4.6mm; Lead Dia. 0.5 mm (max)
Q13 = 2N3904: NPN General Purpose Amplifier; Published: 8-Jun-2000; LatestRevisionDate: 15-Jan-2003; LatestRevisionNote: PCB Footprint 'BCY-W3/D4.7' replaced; DatasheetVersion: 1997; PackageVersion: Sep-1998; PackageReference: TO-92A; Publisher: Altium Limited; PackageDescription: TO, Flat Index; 3 In-Line, Axial Leads; Body Dia. 4.5mm; Leads 0.51 x 0.48 mm (max); ComponentLink1Description: Manufacturer Link; ComponentLink1URL: http://www.fairchildsemi.com/; ComponentLink2Description: Datasheet; ComponentLink2URL: http://www.fairchildsemi.com/ds/2N%2F2N3904.pdf
R44-R46 R49-R60 R91-R112 R118 = Res3: Resistor; Published: 8-Jun-2000; LatestRevisionDate: 29-May-2009; LatestRevisionNote: IPC-7351 Footprint Added.; PackageReference: J1-0603; Publisher: Altium Limited; PackageDescription: Chip Resistor
U19 U20 = BUTTON
Y1 = XTAL: Crystal Oscillator; Published: 8-Jun-2000; LatestRevisionDate: 17-Jul-2002; LatestRevisionNote: Re-released for DXP Platform.; PackageReference: R38; Publisher: Altium Limited; PackageDescription: Crystal, Thru-Hole; 2 Leads; Body 3.1 x 8.2 mm (Dia.xH)

## Sheet RTC.SchDoc
size A4
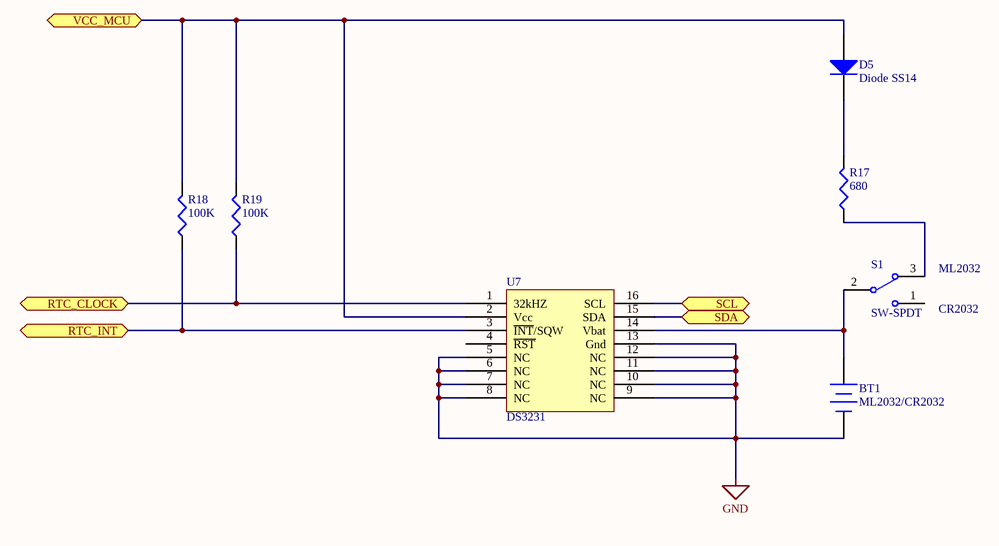
[diagram p3: RTC.SchDoc]

### Parts
BT1  ML2032/CR2032  [BAT2025-2032]
D5  Diode SS14  [SMA]
R17  value 680  [0603]  (hidden comment: Res3)
R18  value 100K  [0603]  (hidden comment: Res3)
R19  value 100K  [0603]  (hidden comment: Res3)
S1  SW-SPDT  [SW-SPDT]
U7  DS3231  [WSO16_M]

### Ports
RTC_CLOCK (bidir), RTC_INT (bidir), SCL (bidir), SDA (bidir), VCC_MCU (bidir)

### Nets
GND: BT1.2(-) U7.5(NC) U7.6(NC) U7.7(NC) U7.8(NC) U7.9(NC) U7.10(NC) U7.11(NC) U7.12(NC) U7.13(Gnd)
VCC_MCU: D5.1(A) R18.2 R19.2 U7.2(Vcc) ; port VCC_MCU
RTC_INT: R18.1 U7.3(~{INT}/SQW) ; port RTC_INT
SCL: U7.16(SCL) ; port SCL
SDA: U7.15(SDA) ; port SDA
NetBT1_1: BT1.1(+) S1.2 U7.14(Vbat)
NetD5_2: D5.2(K) R17.2
NetR17_1: R17.1 S1.3
NetR19_1: R19.1 U7.1(32kHZ) ; port RTC_CLOCK

Not connected (* = marked no-connect by the designer): S1 1; U7 4(~{RST})

### Notes on the sheet
- (near S1) ML2032
- (near S1) CR2032

### Library data of the parts
BT1 = Battery: Multicell Battery; Published: 24-Mar-1999; LatestRevisionDate: 17-Jul-2002; LatestRevisionNote: Re-released for DXP Platform.; PackageReference: BAT-2; Publisher: Altium Limited; PackageDescription: Battery; 2 Leads
D5 = Diode 1N4005: 1 Amp General Purpose Rectifier; Published: 8-Jun-2000; LatestRevisionDate: 17-Jul-2002; LatestRevisionNote: Re-released for DXP Platform.; DatasheetVersion: 1998; PackageVersion: Aug-1999; PackageReference: DO-41; Publisher: Altium Limited; PackageDescription: Diode, Axial; Body 5.2 x 2.7 mm (LxDia. max), Lead Dia. 0.86 mm (max); Code_JEDEC: DO-204-AL; ComponentLink1Description: Manufacturer Link; ComponentLink1URL: http://www.fairchildsemi.com/; ComponentLink2Description: Datasheet; ComponentLink2URL: http://www.fairchildsemi.com/ds/1N%2F1N4001.pdf
R17-R19 = Res3: Resistor; Published: 8-Jun-2000; LatestRevisionDate: 29-May-2009; LatestRevisionNote: IPC-7351 Footprint Added.; PackageReference: J1-0603; Publisher: Altium Limited; PackageDescription: Chip Resistor
S1 = SW-SPDT: SPDT Subminiature Toggle Switch, Right Angle Mounting, Vertical Actuation; Published: 24-Mar-1999; LatestRevisionDate: 17-Dec-2003; LatestRevisionNote: Schematic revised, PCB Footprint replaced.; DatasheetVersion: 05-Dec-2000; PackageReference: TL36WW15050; Publisher: Altium Limited; PackageDescription: Switch; 4 Leads; ComponentLink1Description: Manufacturer Link; ComponentLink1URL: http://www.apem.com

## Sheet Fuse.SchDoc
size A2
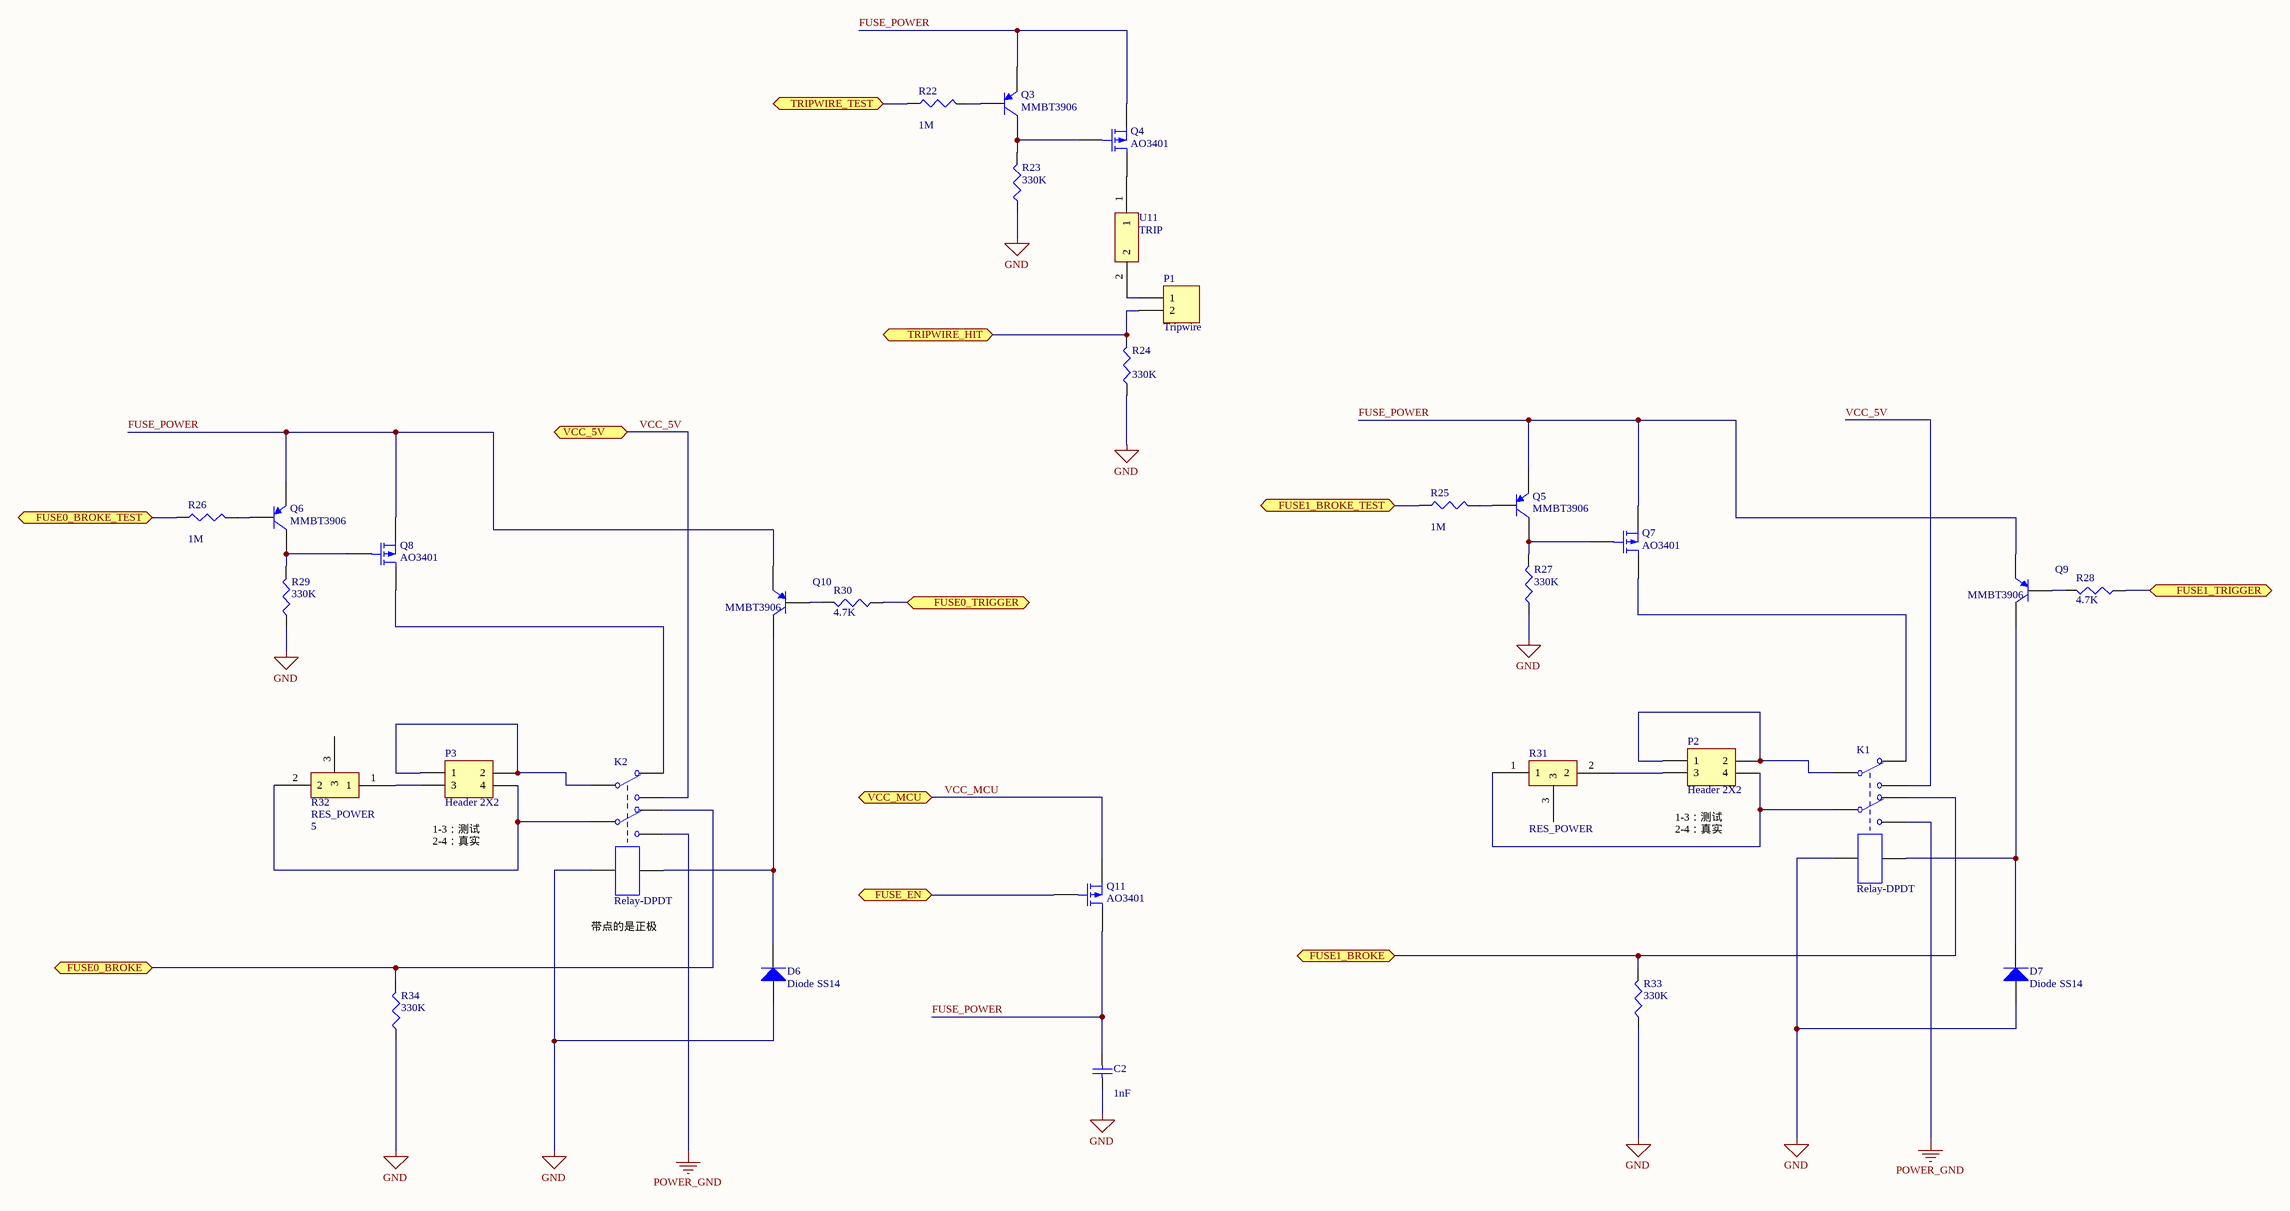
[diagram p4: Fuse.SchDoc]

### Parts
C2  value 1nF  [0603]  (hidden comment: Cap Semi)
D6  Diode SS14  [SMA]
D7  Diode SS14  [SMA]
K1  Relay-DPDT  [G6K2PY]
K2  Relay-DPDT  [G6K2PY]
P1  Tripwire  [HDR1X2]
P2  Header 2X2  [HDR2X2]
P3  Header 2X2  [HDR2X2]
Q3  MMBT3906  [SOT23-3-PNP]
Q4  AO3401  [SOT23-3-PMOS]
Q5  MMBT3906  [SOT23-3-PNP]
Q6  MMBT3906  [SOT23-3-PNP]
Q7  AO3401  [SOT23-3-PMOS]
Q8  AO3401  [SOT23-3-PMOS]
Q9  MMBT3906  [SOT23-3-PNP]
Q10  MMBT3906  [SOT23-3-PNP]
Q11  AO3401  [SOT23-3-PMOS]
R22  value 1M  [0603]  (hidden comment: Res3)
R23  value 330K  [0603]  (hidden comment: Res3)
R24  value 330K  [0603]  (hidden comment: Res3)
R25  value 1M  [0603]  (hidden comment: Res3)
R26  value 1M  [0603]  (hidden comment: Res3)
R27  value 330K  [0603]  (hidden comment: Res3)
R28  value 4.7K  [0603]  (hidden comment: Res3)
R29  value 330K  [0603]  (hidden comment: Res3)
R30  value 4.7K  [0603]  (hidden comment: Res3)
R31  RES_POWER  [RES_POWER]
R32  RES_POWER  value 5  [RES_POWER]
R33  value 330K  [0603]  (hidden comment: Res3)
R34  value 330K  [0603]  (hidden comment: Res3)
U11  TRIP  [TRIP]

### Ports
FUSE0_BROKE (bidir), FUSE0_BROKE_TEST (bidir), FUSE0_TRIGGER (bidir), FUSE1_BROKE (bidir), FUSE1_BROKE_TEST (bidir), FUSE1_TRIGGER (bidir), FUSE_EN (bidir), TRIPWIRE_HIT (bidir), TRIPWIRE_TEST (bidir), VCC_5V (bidir), VCC_MCU (bidir)

### Nets
GND: C2.1 D6.1(A) D7.1(A) K1.7 K2.7 R23.1 R24.1 R27.1 R29.1 R33.1 R34.1
POWER_GND: K1.6 K2.6
VCC_5V: K1.3 K2.3 ; port VCC_5V
VCC_MCU: Q11.3(S) ; port VCC_MCU
FUSE_POWER: C2.2 Q3.3(E) Q4.3(S) Q5.3(E) Q6.3(E) Q7.3(S) Q8.3(S) Q9.3(E) Q10.3(E) Q11.1(D)
NetD6_2: D6.2(K) K2.8 Q10.1(C)
NetD7_2: D7.2(K) K1.8 Q9.1(C)
NetK1_1: K1.1 P2.1 P2.2
NetK1_2: K1.2 Q7.1(D)
NetK1_4: K1.4 P2.4 R31.1
NetK1_5: K1.5 R33.2 ; port FUSE1_BROKE
NetK2_1: K2.1 P3.1 P3.2
NetK2_2: K2.2 Q8.1(D)
NetK2_4: K2.4 P3.4 R32.2
NetK2_5: K2.5 R34.2 ; port FUSE0_BROKE
NetP1_1: P1.1 U11.2
NetP1_2: P1.2 R24.2 ; port TRIPWIRE_HIT
NetP2_3: P2.3 R31.2
NetP3_3: P3.3 R32.1
NetQ3_1: Q3.1(C) Q4.2(G) R23.2
NetQ3_2: Q3.2(B) R22.2
NetQ4_1: Q4.1(D) U11.1
NetQ5_1: Q5.1(C) Q7.2(G) R27.2
NetQ5_2: Q5.2(B) R25.2
NetQ6_1: Q6.1(C) Q8.2(G) R29.2
NetQ6_2: Q6.2(B) R26.2
NetQ9_2: Q9.2(B) R28.2
NetQ10_2: Q10.2(B) R30.2
NetQ11_2: Q11.2(G) ; port FUSE_EN
NetR22_1: R22.1 ; port TRIPWIRE_TEST
NetR25_1: R25.1 ; port FUSE1_BROKE_TEST
NetR26_1: R26.1 ; port FUSE0_BROKE_TEST
NetR28_1: R28.1 ; port FUSE1_TRIGGER
NetR30_1: R30.1 ; port FUSE0_TRIGGER

Not connected (* = marked no-connect by the designer): R31 3; R32 3

### Notes on the sheet
- (near P3) 1-3：测试
  2-4：真实
- (near P2) 1-3：测试
  2-4：真实
- 带点的是正极

### Library data of the parts
C2 = Cap Semi: Capacitor (Semiconductor SIM Model); Published: 8-Jun-2000; LatestRevisionDate: 29-May-2009; LatestRevisionNote: IPC-7351 Footprint Added.; PackageReference: C1206; Publisher: Altium Limited; PackageDescription: Chip Capacitor
D6 D7 = Diode 1N4005: 1 Amp General Purpose Rectifier; Published: 8-Jun-2000; LatestRevisionDate: 17-Jul-2002; LatestRevisionNote: Re-released for DXP Platform.; DatasheetVersion: 1998; PackageVersion: Aug-1999; PackageReference: DO-41; Publisher: Altium Limited; PackageDescription: Diode, Axial; Body 5.2 x 2.7 mm (LxDia. max), Lead Dia. 0.86 mm (max); Code_JEDEC: DO-204-AL; ComponentLink1Description: Manufacturer Link; ComponentLink1URL: http://www.fairchildsemi.com/; ComponentLink2Description: Datasheet; ComponentLink2URL: http://www.fairchildsemi.com/ds/1N%2F1N4001.pdf
K1 K2 = Relay-DPDT: Dual-Pole Dual-Throw Relay; Published: 24-Mar-1999; LatestRevisionDate: 17-Jul-2002; LatestRevisionNote: Re-released for DXP Platform.; PackageReference: DIP-P8; Publisher: Altium Limited; PackageDescription: Relay; 8 Leads
P1 = Header 2: Header, 2-Pin; LatestRevisionDate: 17-Jul-2002; LatestRevisionNote: Re-released for DXP Platform.; Publisher: Altium Limited
P2 P3 = Header 2X2: Header, 2-Pin, Dual row; LatestRevisionDate: 17-Jul-2002; LatestRevisionNote: Re-released for DXP Platform.; Publisher: Altium Limited
Q3 Q5 Q6 Q9 Q10 = PNP: PNP Bipolar Transistor; Published: 8-Jun-2000; LatestRevisionDate: 29-May-2009; LatestRevisionNote: IPC-7351 Footprint Added.; PackageVersion: Aug-1999; PackageReference: SOT-23B; Publisher: Altium Limited; PackageDescription: 3-Pin SOT-23 Package 0.95 mm Pitch, 2.4 mm Lead Span
Q4 Q7 Q8 Q11 = MOSFET-P: P-Channel MOSFET; Published: 8-Jun-2000; LatestRevisionDate: 17-Jul-2002; LatestRevisionNote: Re-released for DXP Platform.; PackageVersion: 1995/1996; PackageReference: E3; Publisher: Altium Limited; PackageDescription: TO, Flat Index; 3 In-Line, Axial Leads; Body Dia. 4.6mm; Lead Dia. 0.5 mm (max)
R22-R30 R33 R34 = Res3: Resistor; Published: 8-Jun-2000; LatestRevisionDate: 29-May-2009; LatestRevisionNote: IPC-7351 Footprint Added.; PackageReference: J1-0603; Publisher: Altium Limited; PackageDescription: Chip Resistor
R31 = RES_POWER: Value: 5

## Sheet MPU.SchDoc
size A4
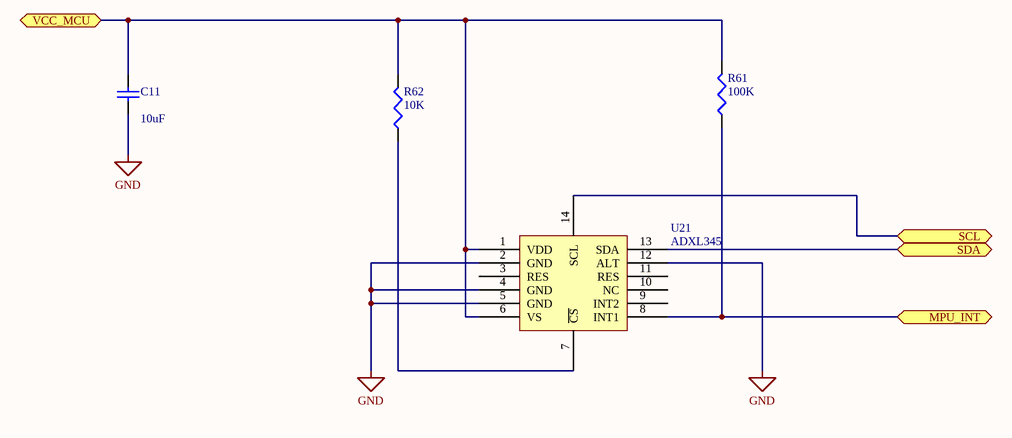
[diagram p5: MPU.SchDoc]

### Parts
C11  value 10uF  [0603]  (hidden comment: Cap Semi)
R61  value 100K  [0603]  (hidden comment: Res3)
R62  value 10K  [0603]  (hidden comment: Res3)
U21  ADXL345  [ALX]

### Ports
MPU_INT (bidir), SCL (bidir), SDA (bidir), VCC_MCU (bidir)

### Nets
GND: C11.1 U21.2(GND) U21.4(GND) U21.5(GND) U21.12(ALT)
VCC_MCU: C11.2 R61.2 R62.2 U21.1(VDD) U21.6(VS) ; port VCC_MCU
MPU_INT: R61.1 U21.8(INT1) ; port MPU_INT
SCL: U21.14(SCL) ; port SCL
SDA: U21.13(SDA) ; port SDA
NetR62_1: R62.1 U21.7(~{CS})

Not connected (* = marked no-connect by the designer): U21 3(RES) 9(INT2) 10(NC) 11(RES)

### Library data of the parts
C11 = Cap Semi: Capacitor (Semiconductor SIM Model); Published: 8-Jun-2000; LatestRevisionDate: 29-May-2009; LatestRevisionNote: IPC-7351 Footprint Added.; PackageReference: C1206; Publisher: Altium Limited; PackageDescription: Chip Capacitor
R61 R62 = Res3: Resistor; Published: 8-Jun-2000; LatestRevisionDate: 29-May-2009; LatestRevisionNote: IPC-7351 Footprint Added.; PackageReference: J1-0603; Publisher: Altium Limited; PackageDescription: Chip Resistor

## Sheet Hg.SchDoc
size A4
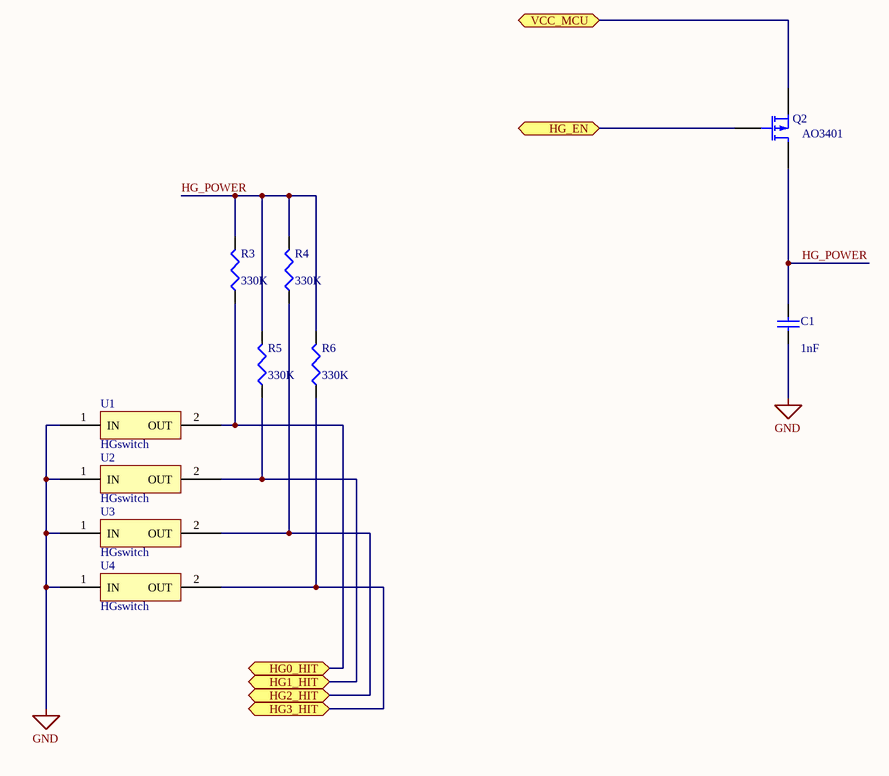
[diagram p6: Hg.SchDoc]

### Parts
C1  value 1nF  [0603]  (hidden comment: Cap Semi)
Q2  AO3401  [SOT23-3-PMOS]
R3  value 330K  [0603]  (hidden comment: Res3)
R4  value 330K  [0603]  (hidden comment: Res3)
R5  value 330K  [0603]  (hidden comment: Res3)
R6  value 330K  [0603]  (hidden comment: Res3)
U1  HGswitch  [HG-H]
U2  HGswitch  [HG-H]
U3  HGswitch  [HG-H]
U4  HGswitch  [HG-H]

### Ports
HG0_HIT (bidir), HG1_HIT (bidir), HG2_HIT (bidir), HG3_HIT (bidir), HG_EN (bidir), VCC_MCU (bidir)

### Nets
GND: C1.1 U1.1(IN) U2.1(IN) U3.1(IN) U4.1(IN)
VCC_MCU: Q2.3(S) ; port VCC_MCU
HG_POWER: C1.2 Q2.1(D) R3.2 R4.2 R5.2 R6.2
NetQ2_2: Q2.2(G) ; port HG_EN
NetR3_1: R3.1 U1.2(OUT) ; port HG0_HIT
NetR4_1: R4.1 U3.2(OUT) ; port HG2_HIT
NetR5_1: R5.1 U2.2(OUT) ; port HG1_HIT
NetR6_1: R6.1 U4.2(OUT) ; port HG3_HIT

### Library data of the parts
C1 = Cap Semi: Capacitor (Semiconductor SIM Model); Published: 8-Jun-2000; LatestRevisionDate: 29-May-2009; LatestRevisionNote: IPC-7351 Footprint Added.; PackageReference: C1206; Publisher: Altium Limited; PackageDescription: Chip Capacitor
Q2 = MOSFET-P: P-Channel MOSFET; Published: 8-Jun-2000; LatestRevisionDate: 17-Jul-2002; LatestRevisionNote: Re-released for DXP Platform.; PackageVersion: 1995/1996; PackageReference: E3; Publisher: Altium Limited; PackageDescription: TO, Flat Index; 3 In-Line, Axial Leads; Body Dia. 4.6mm; Lead Dia. 0.5 mm (max)
R3-R6 = Res3: Resistor; Published: 8-Jun-2000; LatestRevisionDate: 29-May-2009; LatestRevisionNote: IPC-7351 Footprint Added.; PackageReference: J1-0603; Publisher: Altium Limited; PackageDescription: Chip Resistor

## Sheet Thermo.SchDoc
size A4
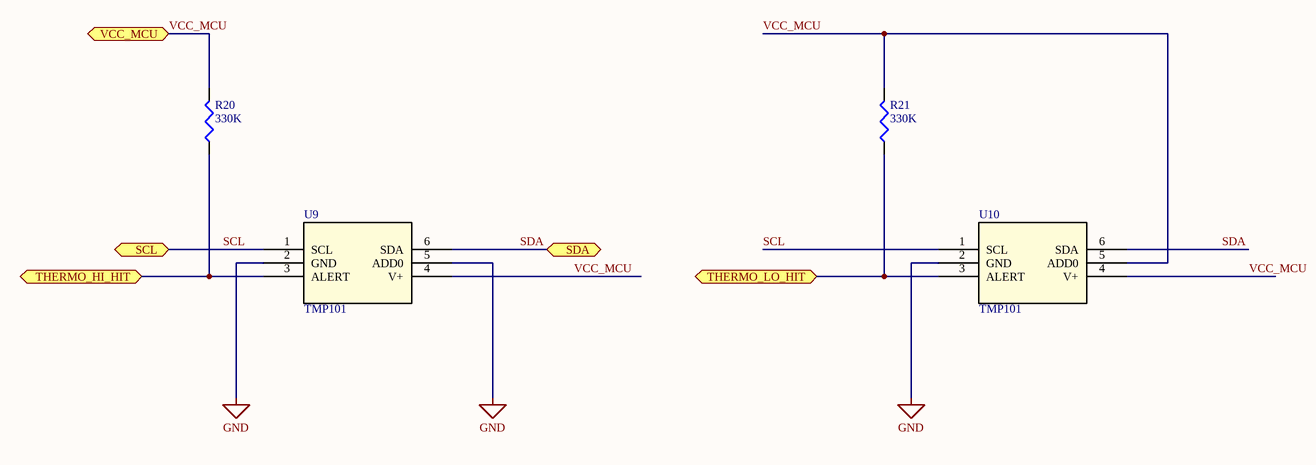
[diagram p7: Thermo.SchDoc]

### Parts
R20  value 330K  [0603]  (hidden comment: Res3)
R21  value 330K  [0603]  (hidden comment: Res3)
U9  TMP101  [SOT23-6]
U10  TMP101  [SOT23-6]

### Ports
SCL (bidir), SDA (bidir), THERMO_HI_HIT (bidir), THERMO_LO_HIT (bidir), VCC_MCU (bidir)

### Nets
GND: U9.2(GND) U9.5(ADD0) U10.2(GND)
VCC_MCU: R20.2 R21.2 U9.4(V+) U10.4(V+) U10.5(ADD0) ; port VCC_MCU
SCL: U9.1(SCL) U10.1(SCL) ; port SCL
SDA: U9.6(SDA) U10.6(SDA) ; port SDA
NetR20_1: R20.1 U9.3(ALERT) ; port THERMO_HI_HIT
NetR21_1: R21.1 U10.3(ALERT) ; port THERMO_LO_HIT

### Library data of the parts
R20 R21 = Res3: Resistor; Published: 8-Jun-2000; LatestRevisionDate: 29-May-2009; LatestRevisionNote: IPC-7351 Footprint Added.; PackageReference: J1-0603; Publisher: Altium Limited; PackageDescription: Chip Resistor
U9 U10 = TMP101: Imported; Manufacturer_Part_Number: tmp101_dbv_6; Vendor: Texas Instruments; PACKAGE_DESIGNATOR: DBV; PIN_COUNT: 6; FAMILY_NAME: TEMPERATURE SENSOR; INDUSTRY_STD_PKG_TYPE: SOT-23; GENERIC_PART_NUMBER: TMP101; Datasheet URL: http://www.ti.com/lit/gpn/TMP101; Manufacturer: Texas Instruments; RefDes: RefDes; Type: DEV

## Sheet Indictor.SchDoc
size A4
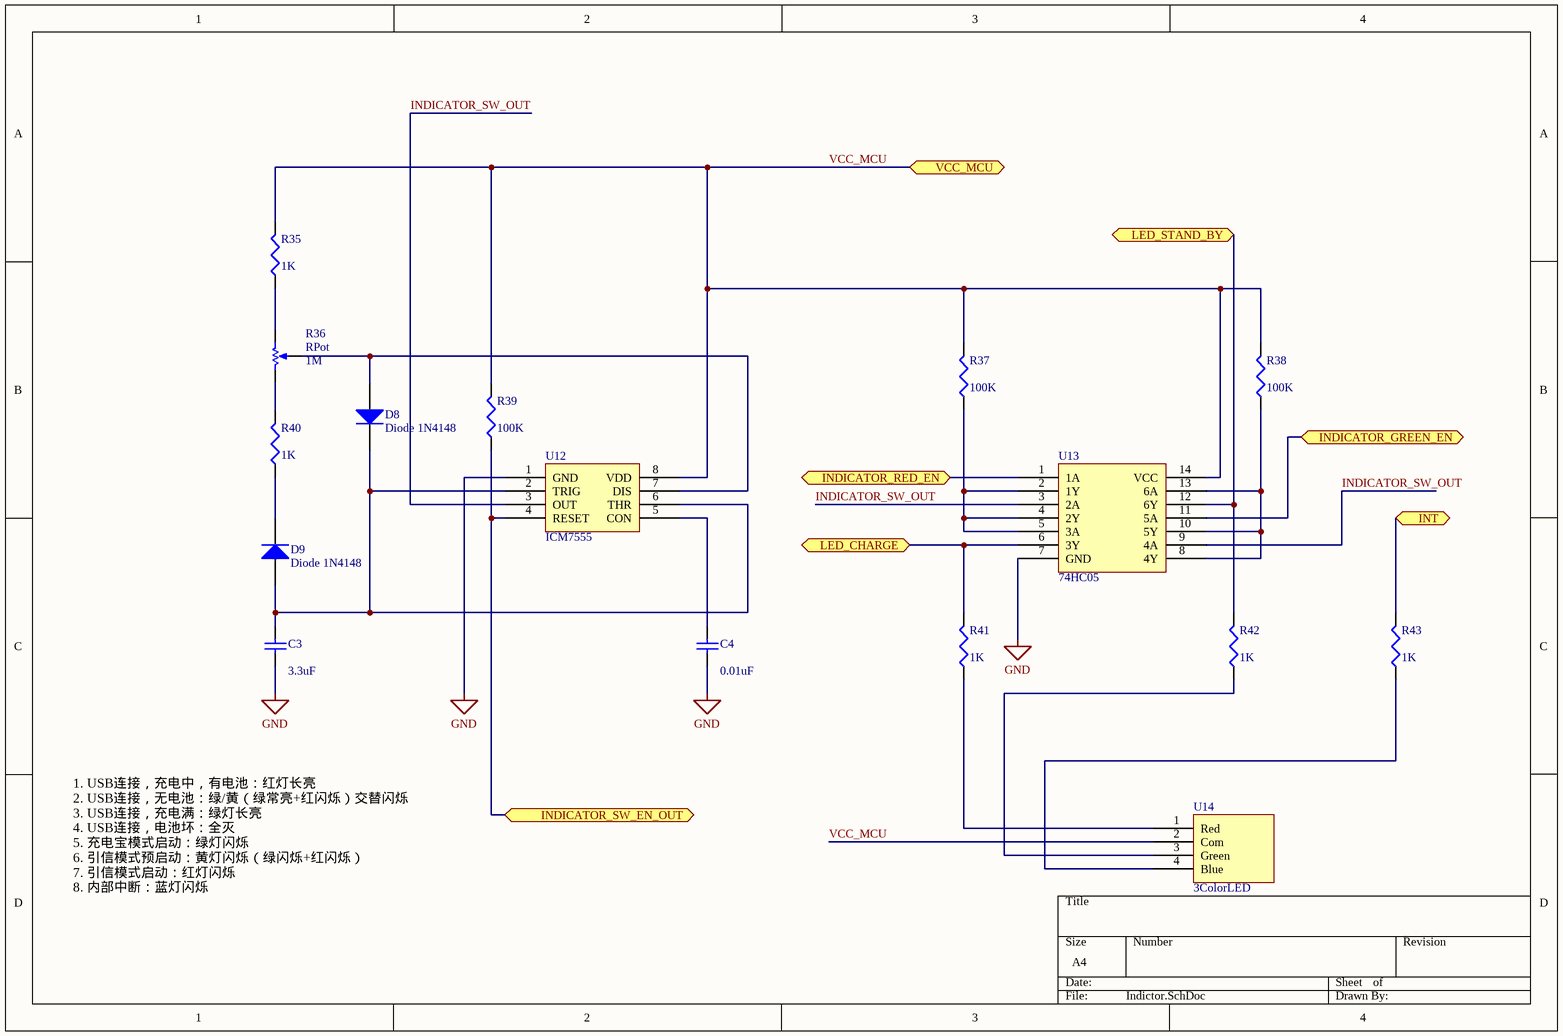
[diagram p8: Indictor.SchDoc]

### Parts
C3  value 3.3uF  [0603]  (hidden comment: Cap Semi)
C4  value 0.01uF  [0603]  (hidden comment: Cap Semi)
D8  Diode 1N4148  [1206D]
D9  Diode 1N4148  [1206D]
R35  value 1K  [0603]  (hidden comment: Res3)
R36  RPot  value 1M  [VR5]
R37  value 100K  [0603]  (hidden comment: Res3)
R38  value 100K  [0603]  (hidden comment: Res3)
R39  value 100K  [0603]  (hidden comment: Res3)
R40  value 1K  [0603]  (hidden comment: Res3)
R41  value 1K  [0603]  (hidden comment: Res3)
R42  value 1K  [0603]  (hidden comment: Res3)
R43  value 1K  [0603]  (hidden comment: Res3)
U12  ICM7555  [SOP8]
U13  74HC05  [TSSOP14]
U14  3ColorLED  [3COLOR-LED]

### Ports
INDICATOR_GREEN_EN (bidir), INDICATOR_RED_EN (bidir), INDICATOR_SW_EN_OUT (bidir), INT (bidir), LED_CHARGE (bidir), LED_STAND_BY (bidir), VCC_MCU (bidir)

### Nets
GND: C3.1 C4.1 U12.1(GND) U13.7(GND)
VCC_MCU: R35.2 R37.2 R38.2 R39.2 U12.8(VDD) U13.14(VCC) U14.2(Com) ; port VCC_MCU
INDICATOR_SW_OUT: U12.3(OUT) U13.3(2A) U13.9(4A)
NetC3_2: C3.2 D8.2(K) D9.1(A) U12.2(TRIG) U12.6(THR)
NetC4_2: C4.2 U12.5(CON)
NetD8_1: D8.1(A) R36.3(TAP) U12.7(DIS)
NetD9_2: D9.2(K) R40.1
NetR11_1: R43.2 ; port INT
NetR35_1: R35.1 R36.1(TOP)
NetR36_2: R36.2(BOT) R40.2
NetR37_1: R37.1 U13.2(1Y) U13.4(2Y) U13.5(3A)
NetR38_1: R38.1 U13.8(4Y) U13.10(5Y) U13.13(6A)
NetR39_1: R39.1 U12.4(RESET) ; port INDICATOR_SW_EN_OUT
NetR41_1: R41.1 U14.1(Red)
NetR41_2: R41.2 U13.6(3Y) ; port LED_CHARGE
NetR42_1: R42.1 U14.3(Green)
NetR42_2: R42.2 U13.12(6Y) ; port LED_STAND_BY
NetR43_1: R43.1 U14.4(Blue)
NetU8_16: U13.1(1A) ; port INDICATOR_RED_EN
NetU8_17: U13.11(5A) ; port INDICATOR_GREEN_EN

### Notes on the sheet
- 1. USB连接，充电中，有电池：红灯长亮
  2. USB连接，无电池：绿/黄（绿常亮+红闪烁）交替闪烁
  3. USB连接，充电满：绿灯长亮
  4. USB连接，电池坏：全灭
  5. 充电宝模式启动：绿灯闪烁
  6. 引信模式预启动：黄灯闪烁（绿闪烁+红闪烁）
  7. 引信模式启动：红灯闪烁
  8. 内部中断：蓝灯闪烁

### Library data of the parts
C3 C4 = Cap Semi: Capacitor (Semiconductor SIM Model); Published: 8-Jun-2000; LatestRevisionDate: 29-May-2009; LatestRevisionNote: IPC-7351 Footprint Added.; PackageReference: C1206; Publisher: Altium Limited; PackageDescription: Chip Capacitor
D8 D9 = Diode 1N4005: 1 Amp General Purpose Rectifier; Published: 8-Jun-2000; LatestRevisionDate: 17-Jul-2002; LatestRevisionNote: Re-released for DXP Platform.; DatasheetVersion: 1998; PackageVersion: Aug-1999; PackageReference: DO-41; Publisher: Altium Limited; PackageDescription: Diode, Axial; Body 5.2 x 2.7 mm (LxDia. max), Lead Dia. 0.86 mm (max); Code_JEDEC: DO-204-AL; ComponentLink1Description: Manufacturer Link; ComponentLink1URL: http://www.fairchildsemi.com/; ComponentLink2Description: Datasheet; ComponentLink2URL: http://www.fairchildsemi.com/ds/1N%2F1N4001.pdf
R35 R37-R43 = Res3: Resistor; Published: 8-Jun-2000; LatestRevisionDate: 29-May-2009; LatestRevisionNote: IPC-7351 Footprint Added.; PackageReference: J1-0603; Publisher: Altium Limited; PackageDescription: Chip Resistor
R36 = RPot: Potentiometer; Sim Note: Enter the Resistance value and the set point into parameter fields.; Set Position: 0.5; Published: 8-Jun-2000; LatestRevisionDate: 17-Jul-2002; LatestRevisionNote: Re-released for DXP Platform.; PackageReference: VR5; Publisher: Altium Limited; PackageDescription: Variable Resistor, Thru-Hole; 3 Leads

## Sheet Radio.SchDoc
size A4
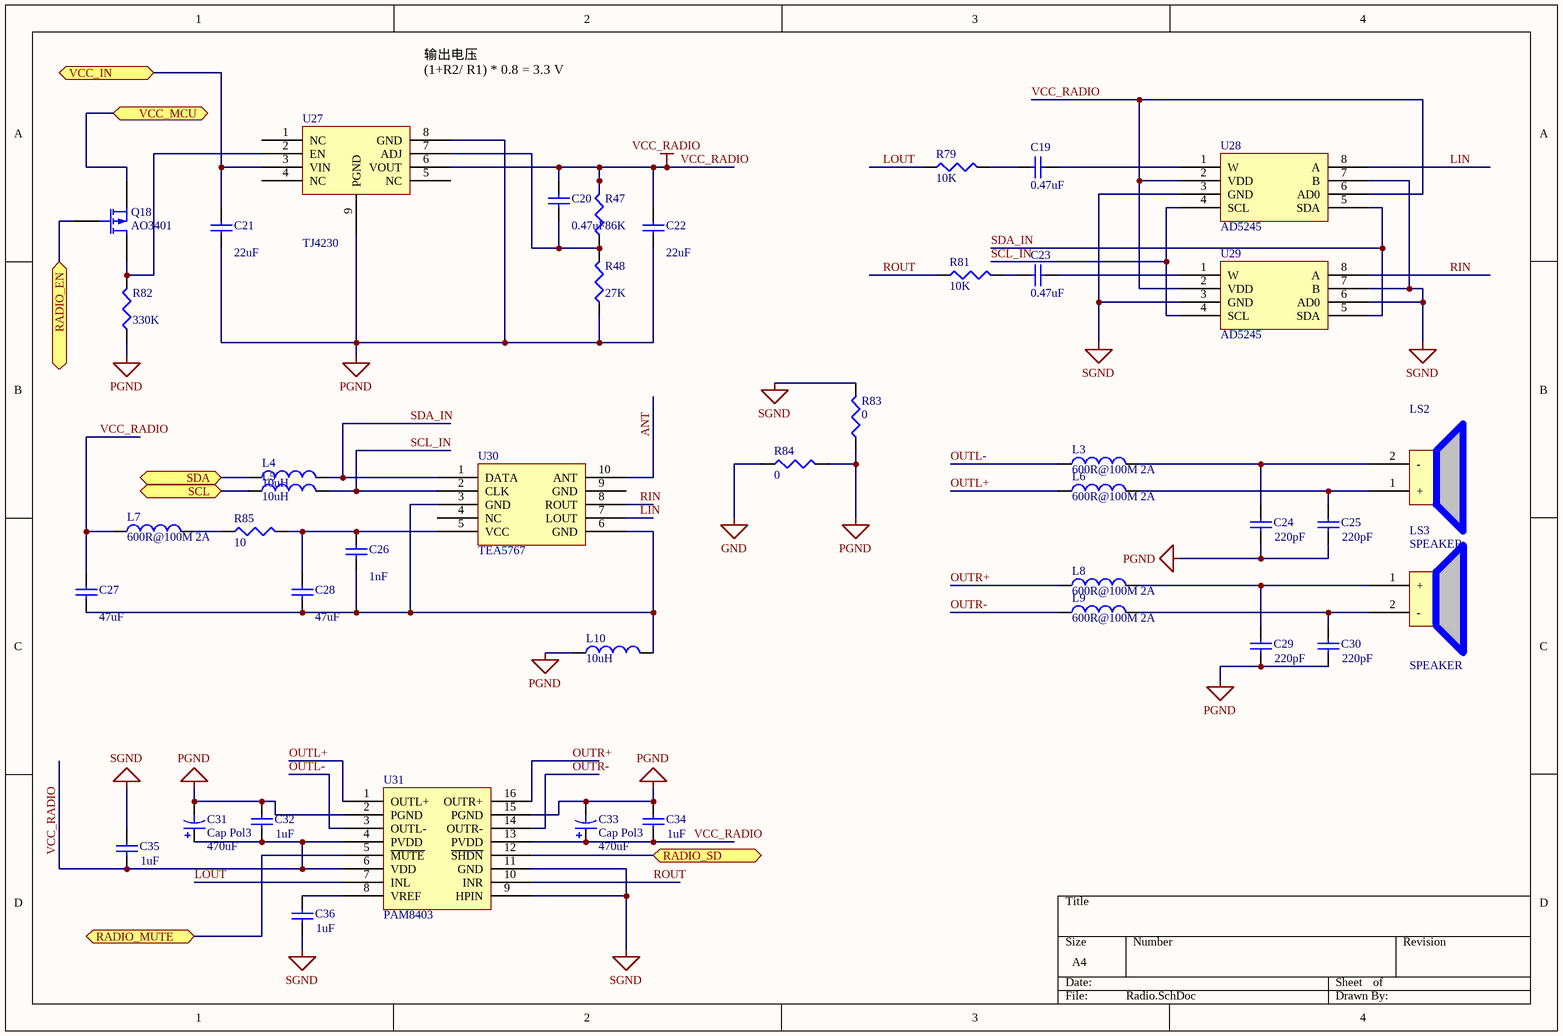
[diagram p9: Radio.SchDoc]

### Parts
C19  value 0.47uF  [0603]  (hidden comment: Cap Semi)
C20  value 0.47uF  [0603]  (hidden comment: Cap Semi)
C21  value 22uF  [1206]  (hidden comment: Cap Semi)
C22  value 22uF  [1206]  (hidden comment: Cap Semi)
C23  value 0.47uF  [0603]  (hidden comment: Cap Semi)
C24  value 220pF  [0603]  (hidden comment: Cap Semi)
C25  value 220pF  [0603]  (hidden comment: Cap Semi)
C26  value 1nF  [0603]  (hidden comment: Cap Semi)
C27  value 47uF  [1210]  (hidden comment: Cap Semi)
C28  value 47uF  [1210]  (hidden comment: Cap Semi)
C29  value 220pF  [0603]  (hidden comment: Cap Semi)
C30  value 220pF  [0603]  (hidden comment: Cap Semi)
C31  Cap Pol3  value 470uF  [TC7343-2917]
C32  value 1uF  [0603]  (hidden comment: Cap Semi)
C33  Cap Pol3  value 470uF  [TC7343-2917]
C34  value 1uF  [0603]  (hidden comment: Cap Semi)
C35  value 1uF  [0603]  (hidden comment: Cap Semi)
C36  value 1uF  [0603]  (hidden comment: Cap Semi)
L3  value 600R@100M 2A  [0805]  (hidden comment: Inductor)
L4  value 10uH  [0603]  (hidden comment: Inductor)
L5  value 10uH  [0603]  (hidden comment: Inductor)
L6  value 600R@100M 2A  [0805]  (hidden comment: Inductor)
L7  value 600R@100M 2A  [0805]  (hidden comment: Inductor)
L8  value 600R@100M 2A  [0805]  (hidden comment: Inductor)
L9  value 600R@100M 2A  [0805]  (hidden comment: Inductor)
L10  value 10uH  [0603]  (hidden comment: Inductor)
LS2  SPEAKER  [SPEAKER]
LS3  SPEAKER  [SPEAKER]
Q18  AO3401  [SOT23-3-PMOS]
R47  value 86K  [0603]  (hidden comment: Res3)
R48  value 27K  [0603]  (hidden comment: Res3)
R79  value 10K  [0603]  (hidden comment: Res3)
R81  value 10K  [0603]  (hidden comment: Res3)
R82  value 330K  [0603]  (hidden comment: Res3)
R83  value 0  [0603]  (hidden comment: Res3)
R84  value 0  [0603]  (hidden comment: Res3)
R85  value 10  [0603]  (hidden comment: Res3)
U27  TJ4230  [SOP8-PAD]
U28  AD5245  [SOT23-8]
U29  AD5245  [SOT23-8]
U30  TEA5767  [TEA5767]
U31  PAM8403  [SOP16]

### Ports
RADIO_EN (bidir), RADIO_MUTE (bidir), RADIO_SD (bidir), SCL (bidir), SDA (bidir), VCC_IN (bidir), VCC_MCU (bidir)

### Nets
GND: R84.1
PGND: C21.1 C22.1 C24.1 C25.1 C29.1 C30.1 C31.2 C32.2 C33.2 C34.2 L10.1 R48.1 R82.1 R83.1 R84.2 U27.8(GND) U27.9(PGND) U31.2(PGND) U31.15(PGND)
SGND: C35.2 C36.1 R83.2 U28.3(GND) U28.7(B) U29.3(GND) U29.6(AD0) U29.7(B) U31.9(HPIN) U31.11(GND)
VCC_IN: C21.2 U27.3(VIN) ; port VCC_IN
VCC_MCU: Q18.3(S) ; port VCC_MCU
VCC_RADIO: C20.2 C22.2 C27.2 C31.1 C32.1 C33.1 C34.1 C35.1 L7.1 R47.2 U27.6(VOUT) U28.2(VDD) U28.6(AD0) U29.2(VDD) U31.4(PVDD) U31.6(VDD) U31.13(PVDD)
ANT: U30.10(ANT)
LIN: U28.8(A) U30.7(LOUT)
LOUT: R79.1 U31.7(INL)
OUTL+: L6.1 U31.1(OUTL+)
OUTL-: L3.1 U31.3(OUTL-)
OUTR+: L8.1 U31.16(OUTR+)
OUTR-: L9.1 U31.14(OUTR-)
RIN: U29.8(A) U30.8(ROUT)
ROUT: R81.1 U31.10(INR)
SCL: L5.1 ; port SCL
SCL_IN: L5.2 U28.4(SCL) U29.4(SCL) U30.2(CLK)
SDA: L4.1 ; port SDA
SDA_IN: L4.2 U28.5(SDA) U29.5(SDA) U30.1(DATA)
NetC19_1: C19.1 R79.2
NetC19_2: C19.2 U28.1(W)
NetC20_1: C20.1 R47.1 R48.2 U27.7(ADJ)
NetC23_1: C23.1 R81.2
NetC23_2: C23.2 U29.1(W)
NetC24_2: C24.2 L3.2 LS2.2(-)
NetC25_2: C25.2 L6.2 LS2.1(+)
NetC26_1: C26.1 C27.1 C28.1 L10.2 U30.3(GND) U30.6(GND)
NetC26_2: C26.2 C28.2 R85.2 U30.5(VCC)
NetC29_2: C29.2 L8.2 LS3.1(+)
NetC30_2: C30.2 L9.2 LS3.2(-)
NetC36_2: C36.2 U31.8(VREF)
NetL7_2: L7.2 R85.1
NetQ18_1: Q18.1(D) R82.2 U27.2(EN)
NetQ18_2: Q18.2(G) ; port RADIO_EN
NetU8_18: U31.12(~{SHDN}) ; port RADIO_SD
NetU8_19: U31.5(~{MUTE}) ; port RADIO_MUTE

Not connected (* = marked no-connect by the designer): U27 1(NC) 4(NC) 5(NC); U30 4(NC) 9(GND)

### Notes on the sheet
- 输出电压
  (1+R2/ R1) * 0.8 = 3.3 V

### Library data of the parts
C19-C30 C32 C34-C36 = Cap Semi: Capacitor (Semiconductor SIM Model); Published: 8-Jun-2000; LatestRevisionDate: 29-May-2009; LatestRevisionNote: IPC-7351 Footprint Added.; PackageReference: C1206; Publisher: Altium Limited; PackageDescription: Chip Capacitor
C31 C33 = Cap Pol3: Polarized Capacitor (Surface Mount); Published: 8-Jun-2000; LatestRevisionDate: 29-May-2009; LatestRevisionNote: IPC-7351 Footprint Added.; PackageReference: C0805; Publisher: Altium Limited; PackageDescription: Chip Capacitor
L3-L10 = Inductor: Code_IEC: 1005; Published: 8-Jun-2000; LatestRevisionDate: 29-May-2009; LatestRevisionNote: IPC-7351 Footprint Added.; PackageReference: 0402-A; Publisher: Altium Limited; PackageDescription: Chip Inductor; Code_JEITA: 0402
Q18 = MOSFET-P: P-Channel MOSFET; Published: 8-Jun-2000; LatestRevisionDate: 17-Jul-2002; LatestRevisionNote: Re-released for DXP Platform.; PackageVersion: 1995/1996; PackageReference: E3; Publisher: Altium Limited; PackageDescription: TO, Flat Index; 3 In-Line, Axial Leads; Body Dia. 4.6mm; Lead Dia. 0.5 mm (max)
R47 R48 R79 R81-R85 = Res3: Resistor; Published: 8-Jun-2000; LatestRevisionDate: 29-May-2009; LatestRevisionNote: IPC-7351 Footprint Added.; PackageReference: J1-0603; Publisher: Altium Limited; PackageDescription: Chip Resistor

## Sheet Serial_Hub.SchDoc
size A4
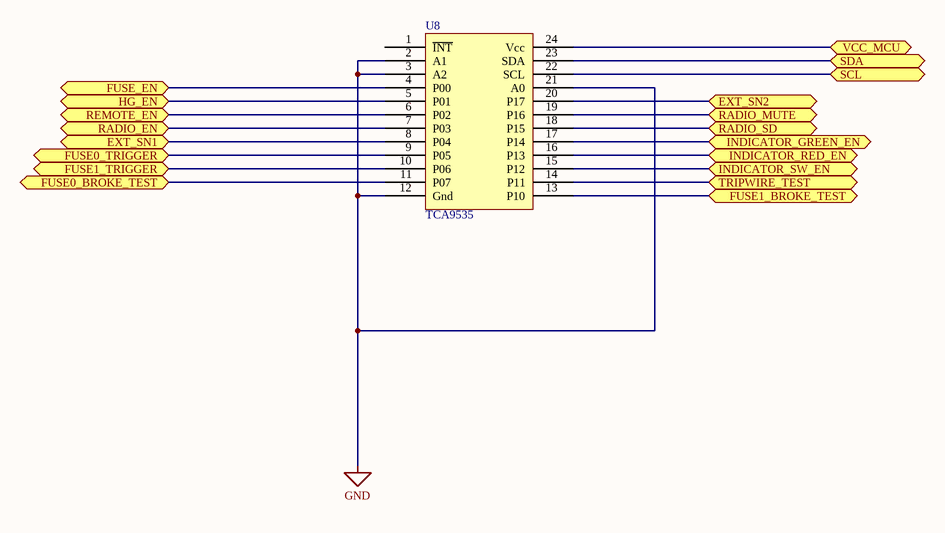
[diagram p10: Serial_Hub.SchDoc]

### Parts
U8  TCA9535  [TSSOP24]

### Ports
EXT_SN1 (bidir), EXT_SN2 (bidir), FUSE0_BROKE_TEST (bidir), FUSE0_TRIGGER (bidir), FUSE1_BROKE_TEST (bidir), FUSE1_TRIGGER (bidir), FUSE_EN (bidir), HG_EN (bidir), INDICATOR_GREEN_EN (bidir), INDICATOR_RED_EN (bidir), INDICATOR_SW_EN (bidir), RADIO_EN (bidir), RADIO_MUTE (bidir), RADIO_SD (bidir), REMOTE_EN (bidir), SCL (bidir), SDA (bidir), TRIPWIRE_TEST (bidir), VCC_MCU (bidir)

### Nets
GND: U8.2(A1) U8.3(A2) U8.12(Gnd) U8.21(A0)
VCC_MCU: U8.24(Vcc) ; port VCC_MCU
SCL: U8.22(SCL) ; port SCL
SDA: U8.23(SDA) ; port SDA
NetP10_13: U8.8(P04) ; port EXT_SN1
NetP10_15: U8.20(P17) ; port EXT_SN2
NetQ2_2: U8.5(P01) ; port HG_EN
NetQ11_2: U8.4(P00) ; port FUSE_EN
NetQ18_2: U8.7(P03) ; port RADIO_EN
NetQ19_2: U8.6(P02) ; port REMOTE_EN
NetR22_1: U8.14(P11) ; port TRIPWIRE_TEST
NetR25_1: U8.13(P10) ; port FUSE1_BROKE_TEST
NetR26_1: U8.11(P07) ; port FUSE0_BROKE_TEST
NetR28_1: U8.10(P06) ; port FUSE1_TRIGGER
NetR30_1: U8.9(P05) ; port FUSE0_TRIGGER
NetU8_15: U8.15(P12) ; port INDICATOR_SW_EN
NetU8_16: U8.16(P13) ; port INDICATOR_RED_EN
NetU8_17: U8.17(P14) ; port INDICATOR_GREEN_EN
NetU8_18: U8.18(P15) ; port RADIO_SD
NetU8_19: U8.19(P16) ; port RADIO_MUTE

Not connected (* = marked no-connect by the designer): U8 1(~{INT})

## Sheet Int_Hub.SchDoc
size A4
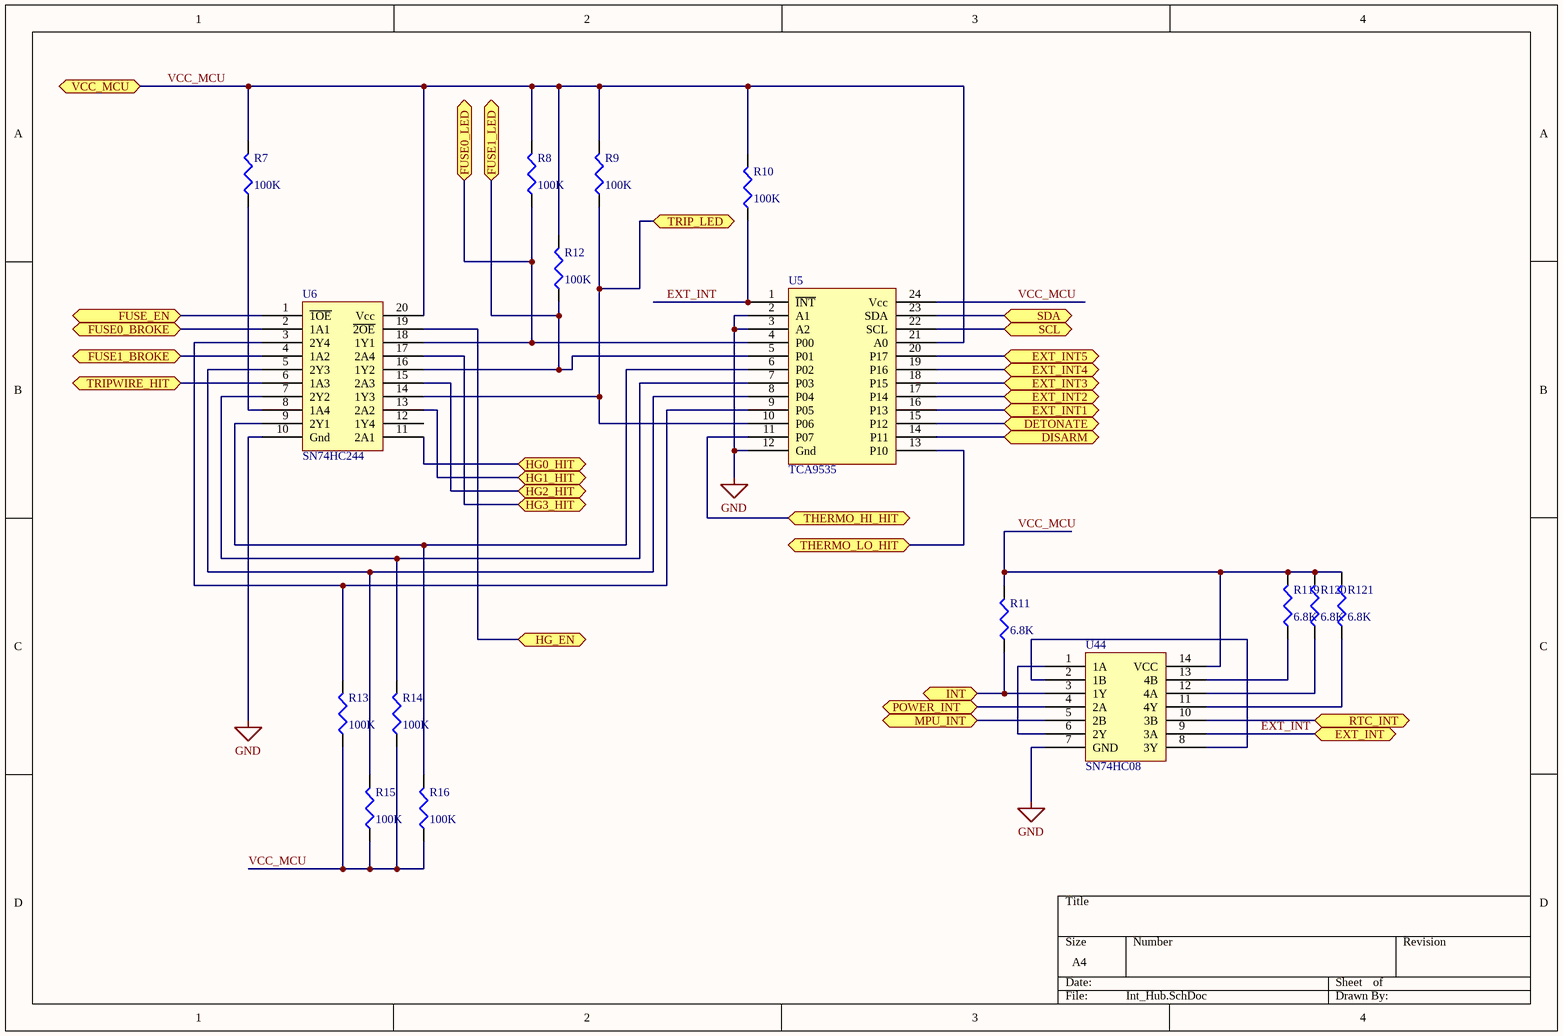
[diagram p11: Int_Hub.SchDoc]

### Parts
R7  value 100K  [0603]  (hidden comment: Res3)
R8  value 100K  [0603]  (hidden comment: Res3)
R9  value 100K  [0603]  (hidden comment: Res3)
R10  value 100K  [0603]  (hidden comment: Res3)
R11  value 6.8K  [0603]  (hidden comment: Res3)
R12  value 100K  [0603]  (hidden comment: Res3)
R13  value 100K  [0603]  (hidden comment: Res3)
R14  value 100K  [0603]  (hidden comment: Res3)
R15  value 100K  [0603]  (hidden comment: Res3)
R16  value 100K  [0603]  (hidden comment: Res3)
R119  value 6.8K  [0603]  (hidden comment: Res3)
R120  value 6.8K  [0603]  (hidden comment: Res3)
R121  value 6.8K  [0603]  (hidden comment: Res3)
U5  TCA9535  [TSSOP24]
U6  SN74HC244  [TSSOP20]
U44  SN74HC08  [TSSOP14]

### Ports
DETONATE (bidir), DISARM (bidir), EXT_INT1 (bidir), EXT_INT2 (bidir), EXT_INT3 (bidir), EXT_INT4 (bidir), EXT_INT5 (bidir), EXT_INT (bidir), FUSE0_BROKE (bidir), FUSE0_LED (bidir), FUSE1_BROKE (bidir), FUSE1_LED (bidir), FUSE_EN (bidir), HG0_HIT (bidir), HG1_HIT (bidir), HG2_HIT (bidir), HG3_HIT (bidir), HG_EN (bidir), INT (bidir), MPU_INT (bidir), POWER_INT (bidir), RTC_INT (bidir), SCL (bidir), SDA (bidir), THERMO_HI_HIT (bidir), THERMO_LO_HIT (bidir), TRIP_LED (bidir), TRIPWIRE_HIT (bidir), VCC_MCU (bidir)

### Nets
GND: U5.2(A1) U5.3(A2) U5.12(Gnd) U6.10(Gnd) U44.7(GND)
VCC_MCU: R7.2 R8.2 R9.2 R10.2 R11.2 R12.2 R13.1 R14.1 R15.1 R16.1 R119.2 R120.2 R121.2 U5.21(A0) U5.24(Vcc) U6.20(Vcc) U44.14(VCC) ; port VCC_MCU
EXT_INT: R10.1 U5.1(~{INT}) U44.9(3A) ; port EXT_INT
MPU_INT: U44.5(2B) ; port MPU_INT
POWER_INT: U44.4(2A) ; port POWER_INT
RTC_INT: U44.10(3B) ; port RTC_INT
SCL: U5.22(SCL) ; port SCL
SDA: U5.23(SDA) ; port SDA
NetK1_5: U6.4(1A2) ; port FUSE1_BROKE
NetK2_5: U6.2(1A1) ; port FUSE0_BROKE
NetP1_2: U6.6(1A3) ; port TRIPWIRE_HIT
NetP10_3: U5.20(P17) ; port EXT_INT5
NetP10_5: U5.19(P16) ; port EXT_INT4
NetP10_7: U5.18(P15) ; port EXT_INT3
NetP10_9: U5.17(P14) ; port EXT_INT2
NetP10_11: U5.16(P13) ; port EXT_INT1
NetQ2_2: U6.19(~{2OE}) ; port HG_EN
NetQ11_2: U6.1(~{1OE}) ; port FUSE_EN
NetR3_1: U6.11(2A1) ; port HG0_HIT
NetR4_1: U6.15(2A3) ; port HG2_HIT
NetR5_1: U6.13(2A2) ; port HG1_HIT
NetR6_1: U6.17(2A4) ; port HG3_HIT
NetR7_1: R7.1 U6.8(1A4)
NetR8_1: R8.1 U5.4(P00) U6.18(1Y1) ; port FUSE0_LED
NetR9_1: R9.1 U5.10(P06) U6.14(1Y3) ; port TRIP_LED
NetR11_1: R11.1 U44.3(1Y) ; port INT
NetR12_1: R12.1 U5.5(P01) U6.16(1Y2) ; port FUSE1_LED
NetR13_2: R13.2 U5.9(P05) U6.3(2Y4)
NetR14_2: R14.2 U5.7(P03) U6.7(2Y2)
NetR15_2: R15.2 U5.8(P04) U6.5(2Y3)
NetR16_2: R16.2 U5.6(P02) U6.9(2Y1)
NetR20_1: U5.11(P07) ; port THERMO_HI_HIT
NetR21_1: U5.13(P10) ; port THERMO_LO_HIT
NetR87_1: U5.14(P11) ; port DISARM
NetR88_1: U5.15(P12) ; port DETONATE
NetR119_1: R119.1 U44.13(4B)
NetR120_1: R120.1 U44.12(4A)
NetR121_1: R121.1 U44.11(4Y)
NetU44_1: U44.1(1A) U44.6(2Y)
NetU44_2: U44.2(1B) U44.8(3Y)

Not connected (* = marked no-connect by the designer): U6 12(1Y4)

### Library data of the parts
R7-R16 R119-R121 = Res3: Resistor; Published: 8-Jun-2000; LatestRevisionDate: 29-May-2009; LatestRevisionNote: IPC-7351 Footprint Added.; PackageReference: J1-0603; Publisher: Altium Limited; PackageDescription: Chip Resistor

## Sheet Remote.SchDoc
size A4
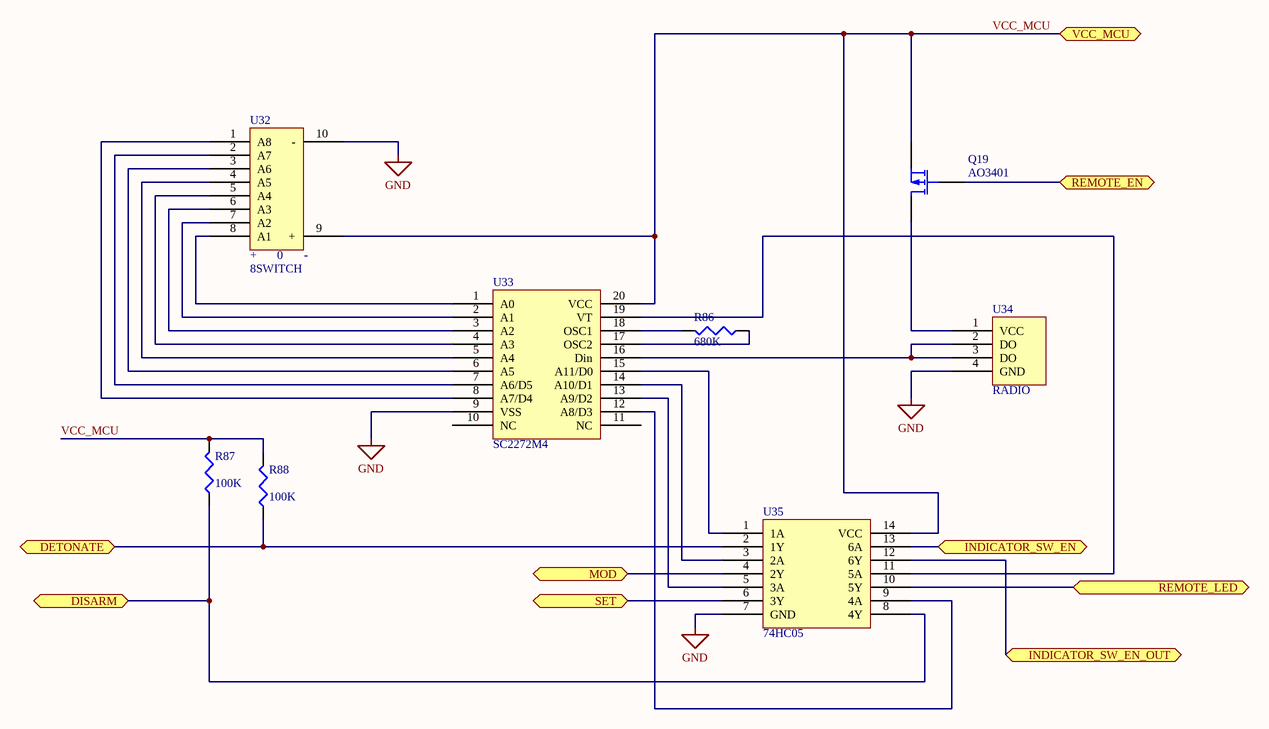
[diagram p12: Remote.SchDoc]

### Parts
Q19  AO3401  [SOT23-3-PMOS]
R86  value 680K  [0603]  (hidden comment: Res3)
R87  value 100K  [0603]  (hidden comment: Res3)
R88  value 100K  [0603]  (hidden comment: Res3)
U32  8SWITCH  [DSDT08LSGET]
U33  SC2272M4  [WSO20_M]
U34  RADIO  [RADIO]
U35  74HC05  [TSSOP14]

### Ports
DETONATE (bidir), DISARM (bidir), INDICATOR_SW_EN (bidir), INDICATOR_SW_EN_OUT (bidir), MOD (bidir), REMOTE_EN (bidir), REMOTE_LED (bidir), SET (bidir), VCC_MCU (bidir)

### Nets
GND: U32.10(-) U33.9(VSS) U34.4(GND) U35.7(GND)
VCC_MCU: Q19.3(S) R87.2 R88.2 U32.9(+) U33.20(VCC) U35.14(VCC) ; port VCC_MCU
MOD: U35.4(2Y) ; port MOD
SET: U35.6(3Y) ; port SET
NetQ19_1: Q19.1(D) U34.1(VCC)
NetQ19_2: Q19.2(G) ; port REMOTE_EN
NetR39_1: U35.12(6Y) ; port INDICATOR_SW_EN_OUT
NetR86_1: R86.1 U33.17(OSC2)
NetR86_2: R86.2 U33.18(OSC1)
NetR87_1: R87.1 U35.8(4Y) ; port DISARM
NetR88_1: R88.1 U35.2(1Y) ; port DETONATE
NetR109_2: U35.10(5Y) ; port REMOTE_LED
NetU8_15: U35.13(6A) ; port INDICATOR_SW_EN
NetU32_1: U32.1(A8) U33.8(A7/D4)
NetU32_2: U32.2(A7) U33.7(A6/D5)
NetU32_3: U32.3(A6) U33.6(A5)
NetU32_4: U32.4(A5) U33.5(A4)
NetU32_5: U32.5(A4) U33.4(A3)
NetU32_6: U32.6(A3) U33.3(A2)
NetU32_7: U32.7(A2) U33.2(A1)
NetU32_8: U32.8(A1) U33.1(A0)
NetU33_12: U33.12(A8/D3) U35.9(4A)
NetU33_13: U33.13(A9/D2) U35.5(3A)
NetU33_14: U33.14(A10/D1) U35.3(2A)
NetU33_15: U33.15(A11/D0) U35.1(1A)
NetU33_16: U33.16(Din) U34.2(DO) U34.3(DO)
NetU33_19: U33.19(VT) U35.11(5A)

Not connected (* = marked no-connect by the designer): U33 10(NC) 11(NC)

### Notes on the sheet
- (in symbol 8SWITCH) 0

### Library data of the parts
Q19 = MOSFET-P: P-Channel MOSFET; Published: 8-Jun-2000; LatestRevisionDate: 17-Jul-2002; LatestRevisionNote: Re-released for DXP Platform.; PackageVersion: 1995/1996; PackageReference: E3; Publisher: Altium Limited; PackageDescription: TO, Flat Index; 3 In-Line, Axial Leads; Body Dia. 4.6mm; Lead Dia. 0.5 mm (max)
R86-R88 = Res3: Resistor; Published: 8-Jun-2000; LatestRevisionDate: 29-May-2009; LatestRevisionNote: IPC-7351 Footprint Added.; PackageReference: J1-0603; Publisher: Altium Limited; PackageDescription: Chip Resistor